# EAGLE design Modular-Sensor-Breakout-Board (EAGLE 5.12)

## Sheet 1 of 7
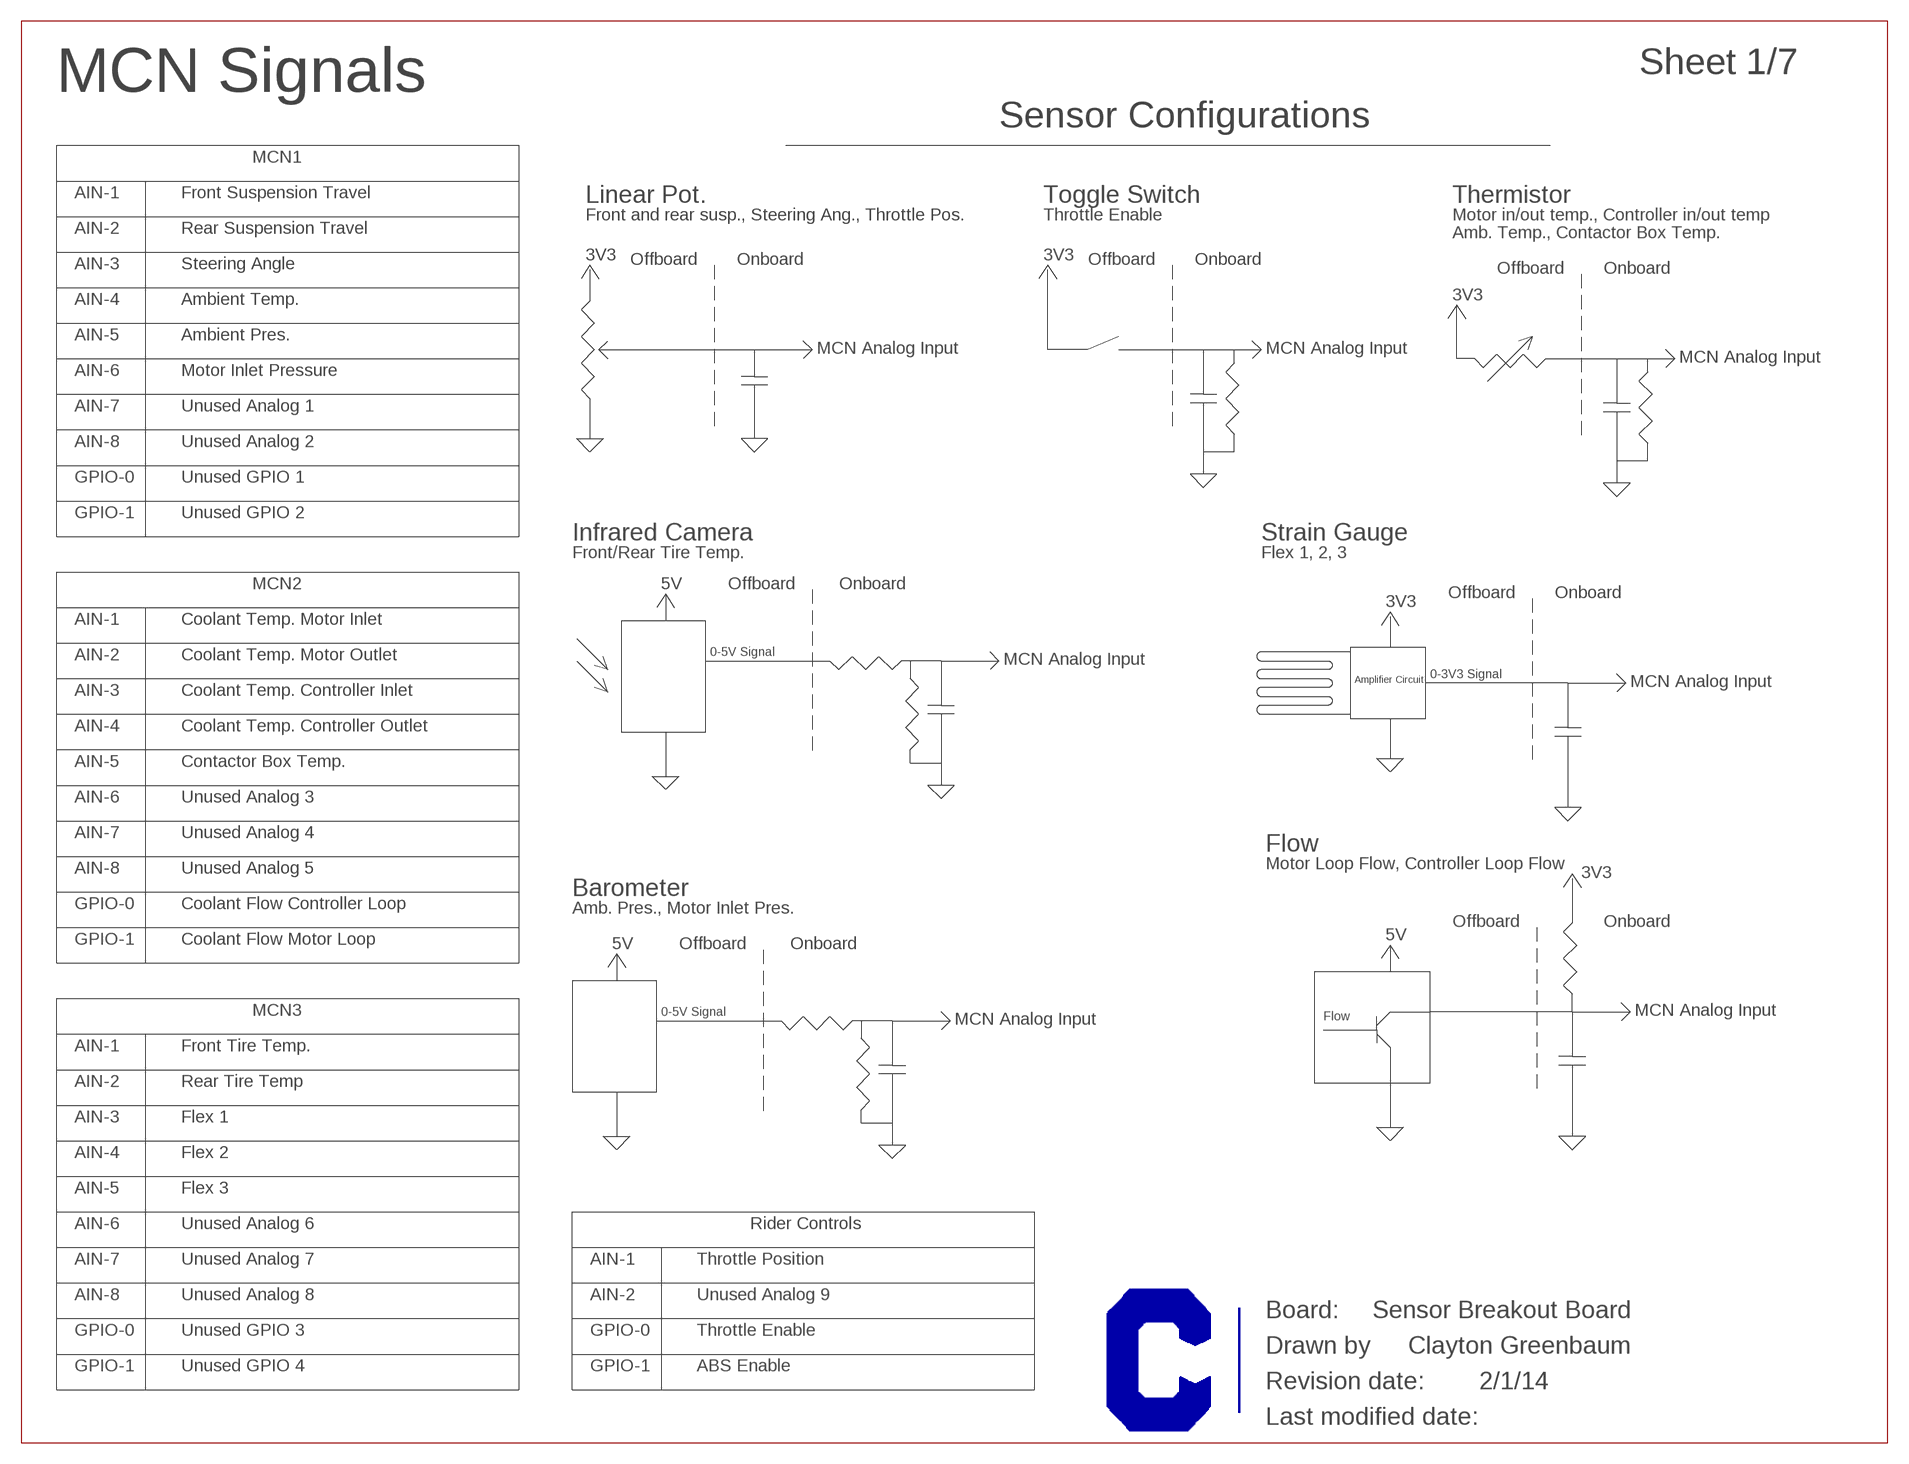
[diagram p0: schematic, sheet 1]

### Notes on the sheet
- MCN Signals
- Sensor Configurations
- MCN1
- AIN-1 | Front Suspension Travel | Linear Pot. | Toggle Switch | Thermistor
- Front and rear susp., Steering Ang., Throttle Pos. | Throttle Enable | Motor in/out temp., Controller in/out temp
- AIN-2 | Rear Suspension Travel | Amb. Temp., Contactor Box Temp.
- 3V3 | Offboard | Onboard | 3V3 | Offboard | Onboard
- AIN-3 | Steering Angle | Offboard | Onboard
- AIN-4 | Ambient Temp. | 3V3
- AIN-5 | Ambient Pres.
- MCN Analog Input | MCN Analog Input
- MCN Analog Input
- AIN-6 | Motor Inlet Pressure
- AIN-7 | Unused Analog 1
- AIN-8 | Unused Analog 2
- GPIO-0 | Unused GPIO 1
- GPIO-1 | Unused GPIO 2
- Infrared Camera | Strain Gauge
- Front/Rear Tire Temp. | Flex 1, 2, 3
- MCN2 | 5V | Offboard | Onboard
- Offboard | Onboard
- 3V3
- AIN-1 | Coolant Temp. Motor Inlet
- 0-5V Signal
- AIN-2 | Coolant Temp. Motor Outlet | MCN Analog Input
- 0-3V3 Signal
- Amplifier Circuit
- MCN Analog Input
- AIN-3 | Coolant Temp. Controller Inlet
- AIN-4 | Coolant Temp. Controller Outlet
- AIN-5 | Contactor Box Temp.
- AIN-6 | Unused Analog 3
- AIN-7 | Unused Analog 4
- Flow
- AIN-8 | Unused Analog 5 | Motor Loop Flow, Controller Loop Flow
- 3V3
- Barometer
- GPIO-0 | Coolant Flow Controller Loop | Amb. Pres., Motor Inlet Pres.
- Offboard | Onboard
- GPIO-1 | Coolant Flow Motor Loop | 5V
- 5V | Offboard | Onboard
- MCN3 | 0-5V Signal | MCN Analog Input
- Flow
- MCN Analog Input
- AIN-1 | Front Tire Temp.
- AIN-2 | Rear Tire Temp
- AIN-3 | Flex 1
- AIN-4 | Flex 2
- AIN-5 | Flex 3
- AIN-6 | Unused Analog 6 | Rider Controls
- AIN-7 | Unused Analog 7 | AIN-1 | Throttle Position
- AIN-8 | Unused Analog 8 | AIN-2 | Unused Analog 9
- Sensor Breakout Board
- GPIO-0 | Unused GPIO 3 | GPIO-0 | Throttle Enable
- Clayton Greenbaum
- GPIO-1 | Unused GPIO 4 | GPIO-1 | ABS Enable
- 2/1/14

## Sheet 2 of 7
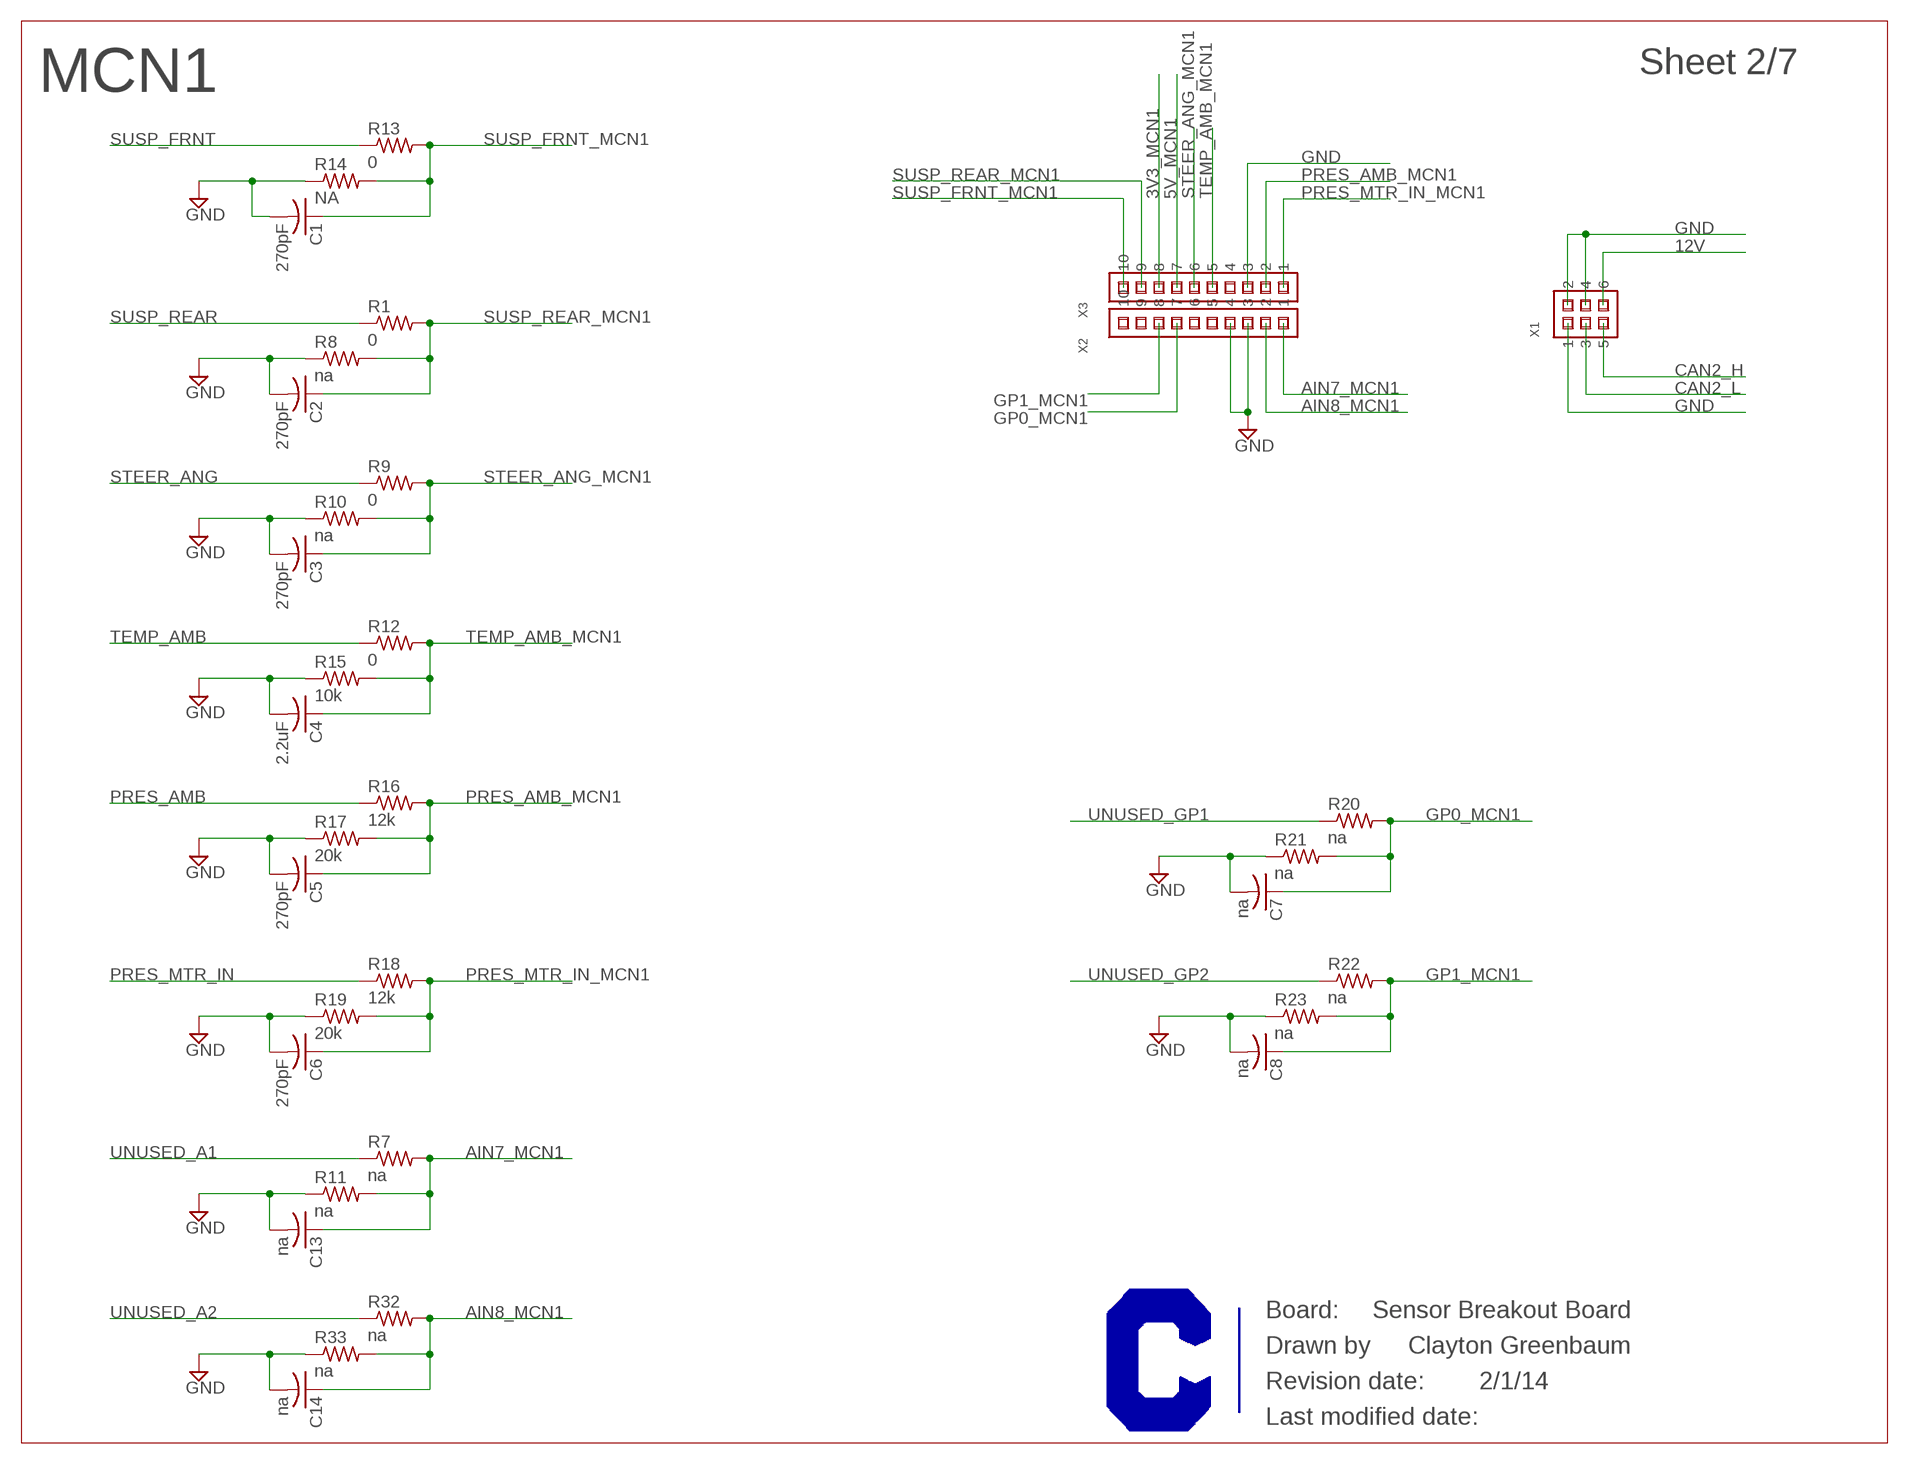
[diagram p1: schematic, sheet 2]

### Parts
C1  270pF  C-USC0603  [C0603]
C2  270pF  C-USC0603  [C0603]
C3  270pF  C-USC0603  [C0603]
C4  2.2uF  C-USC0603  [C0603]
C5  270pF  C-USC0603  [C0603]
C6  270pF  C-USC0603  [C0603]
C7  na  C-USC0603  [C0603]
C8  na  C-USC0603  [C0603]
C13  na  C-USC0603  [C0603]
C14  na  C-USC0603  [C0603]
R1  0  R-US_R0603  [R0603]
R7  na  R-US_R0603  [R0603]
R8  na  R-US_R0603  [R0603]
R9  0  R-US_R0603  [R0603]
R10  na  R-US_R0603  [R0603]
R11  na  R-US_R0603  [R0603]
R12  0  R-US_R0603  [R0603]
R13  0  R-US_R0603  [R0603]
R14  NA  R-US_R0603  [R0603]
R15  10k  R-US_R0603  [R0603]
R16  12k  R-US_R0603  [R0603]
R17  20k  R-US_R0603  [R0603]
R18  12k  R-US_R0603  [R0603]
R19  20k  R-US_R0603  [R0603]
R20  na  R-US_R0603  [R0603]
R21  na  R-US_R0603  [R0603]
R22  na  R-US_R0603  [R0603]
R23  na  R-US_R0603  [R0603]
R32  na  R-US_R0603  [R0603]
R33  na  R-US_R0603  [R0603]
X1  M22-71403XX  [M22-71403XX]
X2  M22-71310XX  [M22-71310XX]
X3  M22-71310XX  [M22-71310XX]

### Nets
3V3_MCN1 [Supply]: X3.8 ; also sheet 7
5V_MCN1 [Supply]: X3.7 ; also sheet 7
12V [Supply]: X1.6 ; also sheet 3,4,5,6,7
AIN7_MCN1: C13.1 R7.2 R11.2 X2.1
AIN8_MCN1: C14.1 R32.2 R33.2 X2.2
CAN2_H: X1.5 ; also sheet 3,4,6,7
CAN2_L: X1.3 ; also sheet 3,4,6,7
GND [Supply]: C1.2 C2.2 C3.2 C4.2 C5.2 C6.2 C7.2 C8.2 C13.2 C14.2 R8.1 R10.1 R11.1 R14.1 R15.1 R17.1 R19.1 R21.1 R23.1 R33.1 X1.1 X1.2 X1.4 X2.3 X2.4 X3.3 ; also sheet 3,4,5,6,7
GP0_MCN1: C7.1 R20.2 R21.2 X2.7
GP1_MCN1: C8.1 R22.2 R23.2 X2.8
PRES_AMB: R16.1 ; also sheet 7
PRES_AMB_MCN1: C5.1 R16.2 R17.2 X3.2
PRES_MTR_IN: R18.1 ; also sheet 7
PRES_MTR_IN_MCN1: C6.1 R18.2 R19.2 X3.1
STEER_ANG: R9.1 ; also sheet 7
STEER_ANG_MCN1: C3.1 R9.2 R10.2 X3.6
SUSP_FRNT: R13.1 ; also sheet 7
SUSP_FRNT_MCN1: C1.1 R13.2 R14.2 X3.10
SUSP_REAR: R1.1 ; also sheet 7
SUSP_REAR_MCN1: C2.1 R1.2 R8.2 X3.9
TEMP_AMB: R12.1 ; also sheet 7
TEMP_AMB_MCN1: C4.1 R12.2 R15.2 X3.5
UNUSED_A1: R7.1 ; also sheet 7
UNUSED_A2: R32.1 ; also sheet 7
UNUSED_GP1: R20.1 ; also sheet 7
UNUSED_GP2: R22.1 ; also sheet 7
Unconnected: X2.5 X2.6 X2.9 X2.10 X3.4

### Notes on the sheet
- MCN1
- Sensor Breakout Board
- Clayton Greenbaum
- 2/1/14

## Sheet 3 of 7
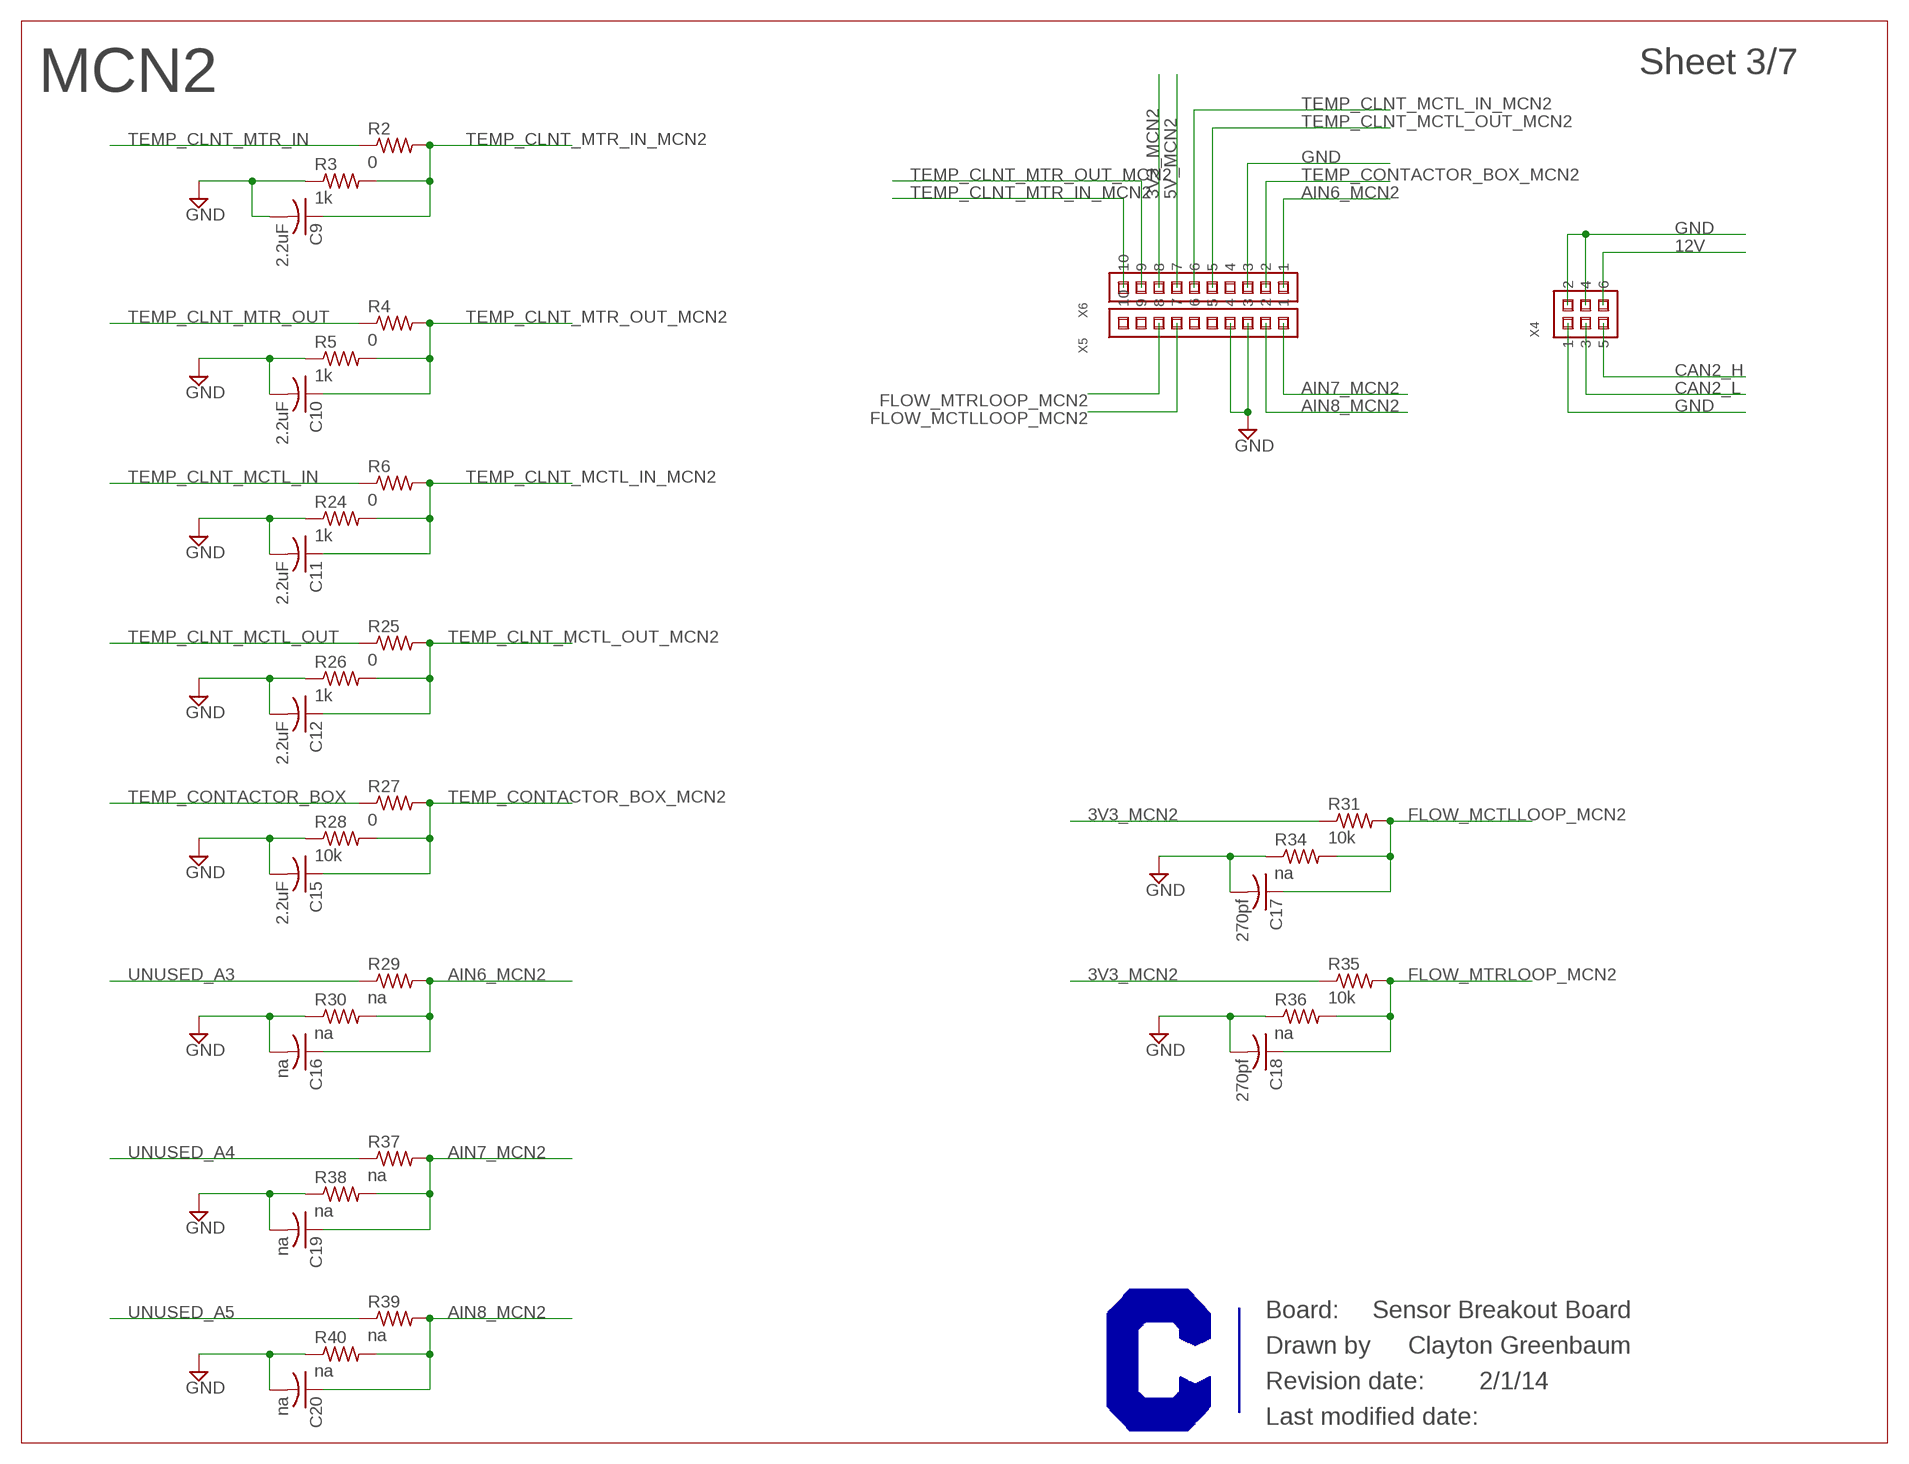
[diagram p2: schematic, sheet 3]

### Parts
C9  2.2uF  C-USC0603  [C0603]
C10  2.2uF  C-USC0603  [C0603]
C11  2.2uF  C-USC0603  [C0603]
C12  2.2uF  C-USC0603  [C0603]
C15  2.2uF  C-USC0603  [C0603]
C16  na  C-USC0603  [C0603]
C17  270pf  C-USC0603  [C0603]
C18  270pf  C-USC0603  [C0603]
C19  na  C-USC0603  [C0603]
C20  na  C-USC0603  [C0603]
R2  0  R-US_R0603  [R0603]
R3  1k  R-US_R0603  [R0603]
R4  0  R-US_R0603  [R0603]
R5  1k  R-US_R0603  [R0603]
R6  0  R-US_R0603  [R0603]
R24  1k  R-US_R0603  [R0603]
R25  0  R-US_R0603  [R0603]
R26  1k  R-US_R0603  [R0603]
R27  0  R-US_R0603  [R0603]
R28  10k  R-US_R0603  [R0603]
R29  na  R-US_R0603  [R0603]
R30  na  R-US_R0603  [R0603]
R31  10k  R-US_R0603  [R0603]
R34  na  R-US_R0603  [R0603]
R35  10k  R-US_R0603  [R0603]
R36  na  R-US_R0603  [R0603]
R37  na  R-US_R0603  [R0603]
R38  na  R-US_R0603  [R0603]
R39  na  R-US_R0603  [R0603]
R40  na  R-US_R0603  [R0603]
X4  M22-71403XX  [M22-71403XX]
X5  M22-71310XX  [M22-71310XX]
X6  M22-71310XX  [M22-71310XX]

### Nets
3V3_MCN2 [Supply]: R31.1 R35.1 X6.8 ; also sheet 7
5V_MCN2 [Supply]: X6.7 ; also sheet 7
12V [Supply]: X4.6 ; also sheet 2,4,5,6,7
AIN6_MCN2: C16.1 R29.2 R30.2 X6.1
AIN7_MCN2: C19.1 R37.2 R38.2 X5.1
AIN8_MCN2: C20.1 R39.2 R40.2 X5.2
CAN2_H: X4.5 ; also sheet 2,4,6,7
CAN2_L: X4.3 ; also sheet 2,4,6,7
FLOW_MCTLLOOP_MCN2: C17.1 R31.2 R34.2 X5.7 ; also sheet 7
FLOW_MTRLOOP_MCN2: C18.1 R35.2 R36.2 X5.8 ; also sheet 7
GND [Supply]: C9.2 C10.2 C11.2 C12.2 C15.2 C16.2 C17.2 C18.2 C19.2 C20.2 R3.1 R5.1 R24.1 R26.1 R28.1 R30.1 R34.1 R36.1 R38.1 R40.1 X4.1 X4.2 X4.4 X5.3 X5.4 X6.3 ; also sheet 2,4,5,6,7
TEMP_CLNT_MCTL_IN: R6.1 ; also sheet 7
TEMP_CLNT_MCTL_IN_MCN2: C11.1 R6.2 R24.2 X6.6
TEMP_CLNT_MCTL_OUT: R25.1 ; also sheet 7
TEMP_CLNT_MCTL_OUT_MCN2: C12.1 R25.2 R26.2 X6.5
TEMP_CLNT_MTR_IN: R2.1 ; also sheet 7
TEMP_CLNT_MTR_IN_MCN2: C9.1 R2.2 R3.2 X6.10
TEMP_CLNT_MTR_OUT: R4.1 ; also sheet 7
TEMP_CLNT_MTR_OUT_MCN2: C10.1 R4.2 R5.2 X6.9
TEMP_CONTACTOR_BOX: R27.1 ; also sheet 7
TEMP_CONTACTOR_BOX_MCN2: C15.1 R27.2 R28.2 X6.2
UNUSED_A3: R29.1 ; also sheet 7
UNUSED_A4: R37.1 ; also sheet 7
UNUSED_A5: R39.1 ; also sheet 7
Unconnected: X5.5 X5.6 X5.9 X5.10 X6.4

### Notes on the sheet
- MCN2
- Sensor Breakout Board
- Clayton Greenbaum
- 2/1/14

## Sheet 4 of 7
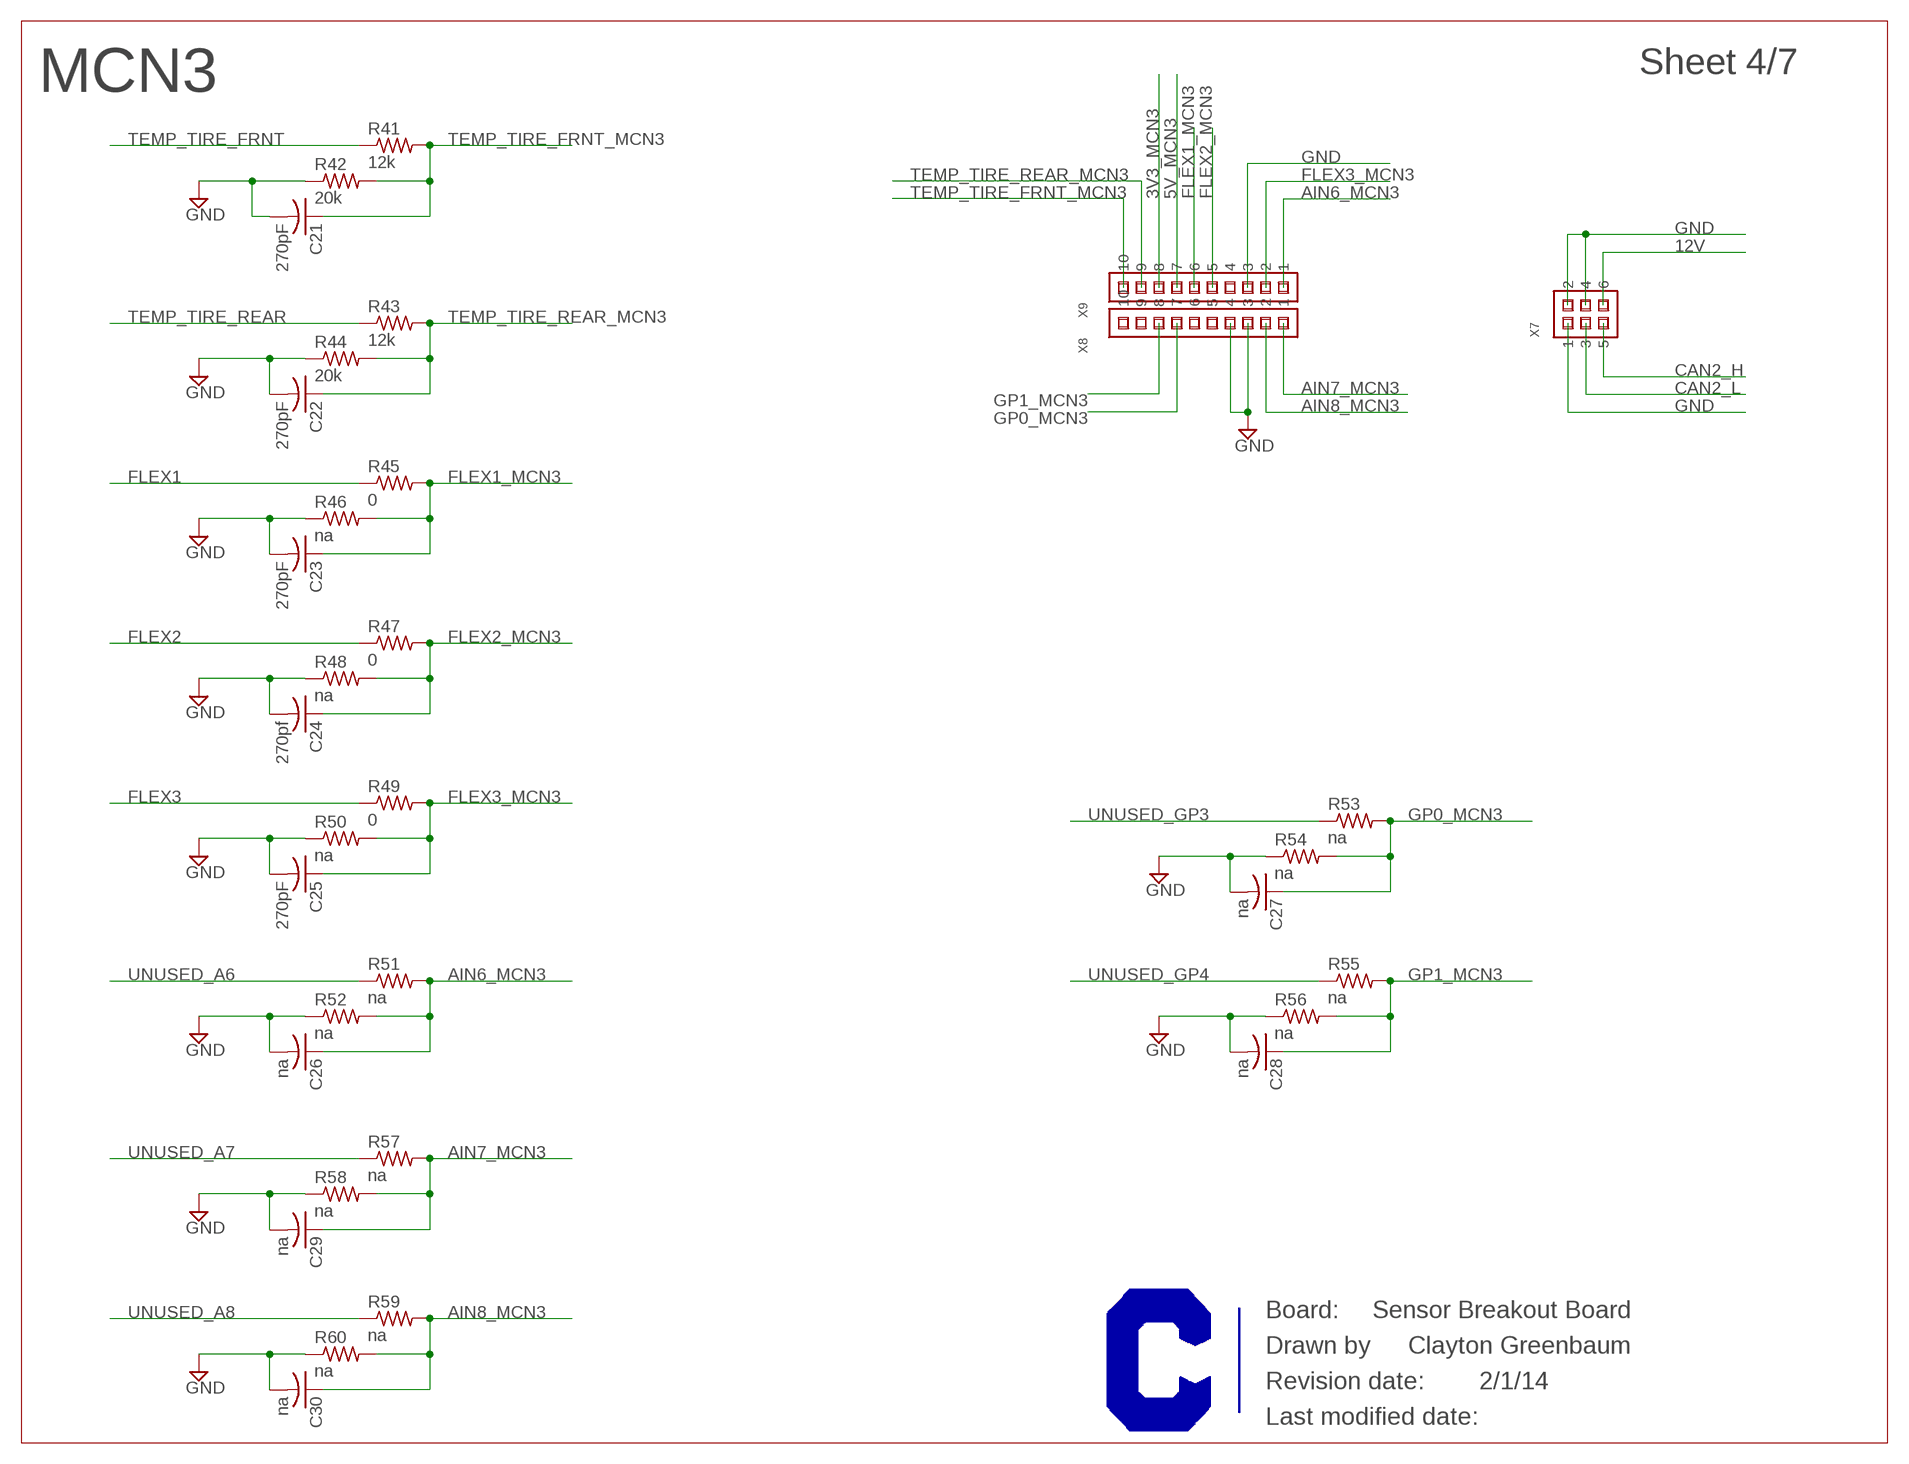
[diagram p3: schematic, sheet 4]

### Parts
C21  270pF  C-USC0603  [C0603]
C22  270pF  C-USC0603  [C0603]
C23  270pF  C-USC0603  [C0603]
C24  270pf  C-USC0603  [C0603]
C25  270pF  C-USC0603  [C0603]
C26  na  C-USC0603  [C0603]
C27  na  C-USC0603  [C0603]
C28  na  C-USC0603  [C0603]
C29  na  C-USC0603  [C0603]
C30  na  C-USC0603  [C0603]
R41  12k  R-US_R0603  [R0603]
R42  20k  R-US_R0603  [R0603]
R43  12k  R-US_R0603  [R0603]
R44  20k  R-US_R0603  [R0603]
R45  0  R-US_R0603  [R0603]
R46  na  R-US_R0603  [R0603]
R47  0  R-US_R0603  [R0603]
R48  na  R-US_R0603  [R0603]
R49  0  R-US_R0603  [R0603]
R50  na  R-US_R0603  [R0603]
R51  na  R-US_R0603  [R0603]
R52  na  R-US_R0603  [R0603]
R53  na  R-US_R0603  [R0603]
R54  na  R-US_R0603  [R0603]
R55  na  R-US_R0603  [R0603]
R56  na  R-US_R0603  [R0603]
R57  na  R-US_R0603  [R0603]
R58  na  R-US_R0603  [R0603]
R59  na  R-US_R0603  [R0603]
R60  na  R-US_R0603  [R0603]
X7  M22-71403XX  [M22-71403XX]
X8  M22-71310XX  [M22-71310XX]
X9  M22-71310XX  [M22-71310XX]

### Nets
3V3_MCN3 [Supply]: X9.8 ; also sheet 7
5V_MCN3 [Supply]: X9.7 ; also sheet 7
12V [Supply]: X7.6 ; also sheet 2,3,5,6,7
AIN6_MCN3: C26.1 R51.2 R52.2 X9.1
AIN7_MCN3: C29.1 R57.2 R58.2 X8.1
AIN8_MCN3: C30.1 R59.2 R60.2 X8.2
CAN2_H: X7.5 ; also sheet 2,3,6,7
CAN2_L: X7.3 ; also sheet 2,3,6,7
FLEX1: R45.1 ; also sheet 7
FLEX1_MCN3: C23.1 R45.2 R46.2 X9.6
FLEX2: R47.1 ; also sheet 7
FLEX2_MCN3: C24.1 R47.2 R48.2 X9.5
FLEX3: R49.1 ; also sheet 7
FLEX3_MCN3: C25.1 R49.2 R50.2 X9.2
GND [Supply]: C21.2 C22.2 C23.2 C24.2 C25.2 C26.2 C27.2 C28.2 C29.2 C30.2 R42.1 R44.1 R46.1 R48.1 R50.1 R52.1 R54.1 R56.1 R58.1 R60.1 X7.1 X7.2 X7.4 X8.3 X8.4 X9.3 ; also sheet 2,3,5,6,7
GP0_MCN3: C27.1 R53.2 R54.2 X8.7
GP1_MCN3: C28.1 R55.2 R56.2 X8.8
TEMP_TIRE_FRNT: R41.1 ; also sheet 7
TEMP_TIRE_FRNT_MCN3: C21.1 R41.2 R42.2 X9.10
TEMP_TIRE_REAR: R43.1 ; also sheet 7
TEMP_TIRE_REAR_MCN3: C22.1 R43.2 R44.2 X9.9
UNUSED_A6: R51.1 ; also sheet 7
UNUSED_A7: R57.1 ; also sheet 7
UNUSED_A8: R59.1 ; also sheet 7
UNUSED_GP3: R53.1 ; also sheet 7
UNUSED_GP4: R55.1 ; also sheet 7
Unconnected: X8.5 X8.6 X8.9 X8.10 X9.4

### Notes on the sheet
- MCN3
- Sensor Breakout Board
- Clayton Greenbaum
- 2/1/14

## Sheet 5 of 7
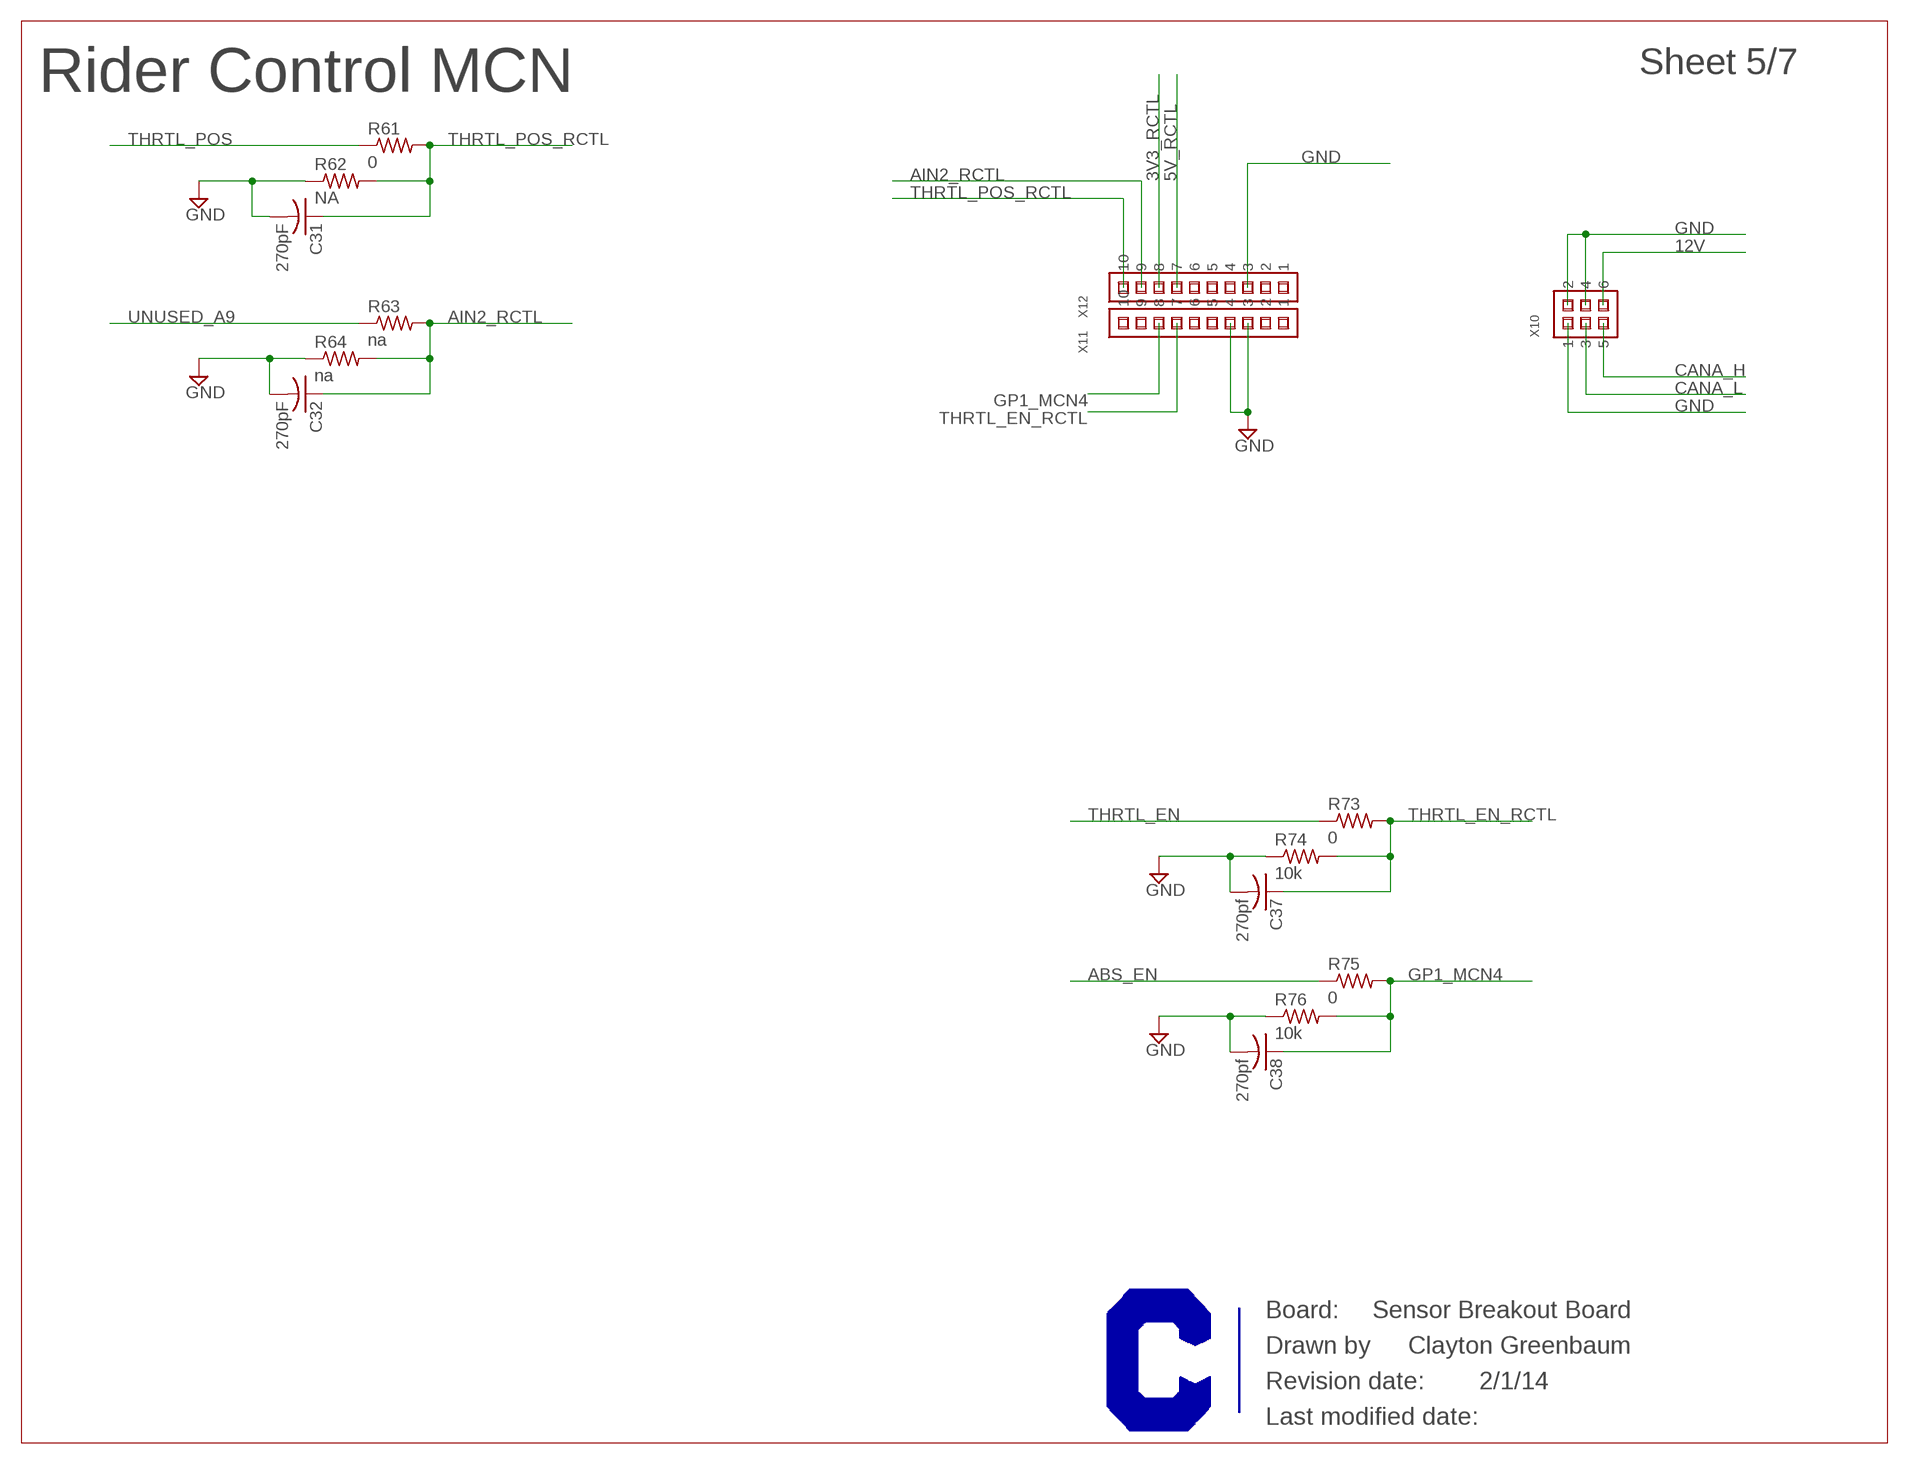
[diagram p4: schematic, sheet 5]

### Parts
C31  270pF  C-USC0603  [C0603]
C32  270pF  C-USC0603  [C0603]
C37  270pf  C-USC0603  [C0603]
C38  270pf  C-USC0603  [C0603]
R61  0  R-US_R0603  [R0603]
R62  NA  R-US_R0603  [R0603]
R63  na  R-US_R0603  [R0603]
R64  na  R-US_R0603  [R0603]
R73  0  R-US_R0603  [R0603]
R74  10k  R-US_R0603  [R0603]
R75  0  R-US_R0603  [R0603]
R76  10k  R-US_R0603  [R0603]
X10  M22-71403XX  [M22-71403XX]
X11  M22-71310XX  [M22-71310XX]
X12  M22-71310XX  [M22-71310XX]

### Nets
3V3_RCTL [Supply]: X12.8 ; also sheet 7
5V_RCTL [Supply]: X12.7 ; also sheet 7
12V [Supply]: X10.6 ; also sheet 2,3,4,6,7
ABS_EN: R75.1 ; also sheet 7
AIN2_RCTL: C32.1 R63.2 R64.2 X12.9
CANA_H: X10.5 ; also sheet 6,7
CANA_L: X10.3 ; also sheet 6,7
GND [Supply]: C31.2 C32.2 C37.2 C38.2 R62.1 R64.1 R74.1 R76.1 X10.1 X10.2 X10.4 X11.3 X11.4 X12.3 ; also sheet 2,3,4,6,7
GP1_MCN4: C38.1 R75.2 R76.2 X11.8
THRTL_EN: R73.1 ; also sheet 7
THRTL_EN_RCTL: C37.1 R73.2 R74.2 X11.7
THRTL_POS: R61.1 ; also sheet 7
THRTL_POS_RCTL: C31.1 R61.2 R62.2 X12.10
UNUSED_A9: R63.1 ; also sheet 7
Unconnected: X11.1 X11.2 X11.5 X11.6 X11.9 X11.10 X12.1 X12.2 X12.4 X12.5 X12.6

### Notes on the sheet
- Rider Control MCN
- Sensor Breakout Board
- Clayton Greenbaum
- 2/1/14

## Sheet 6 of 7
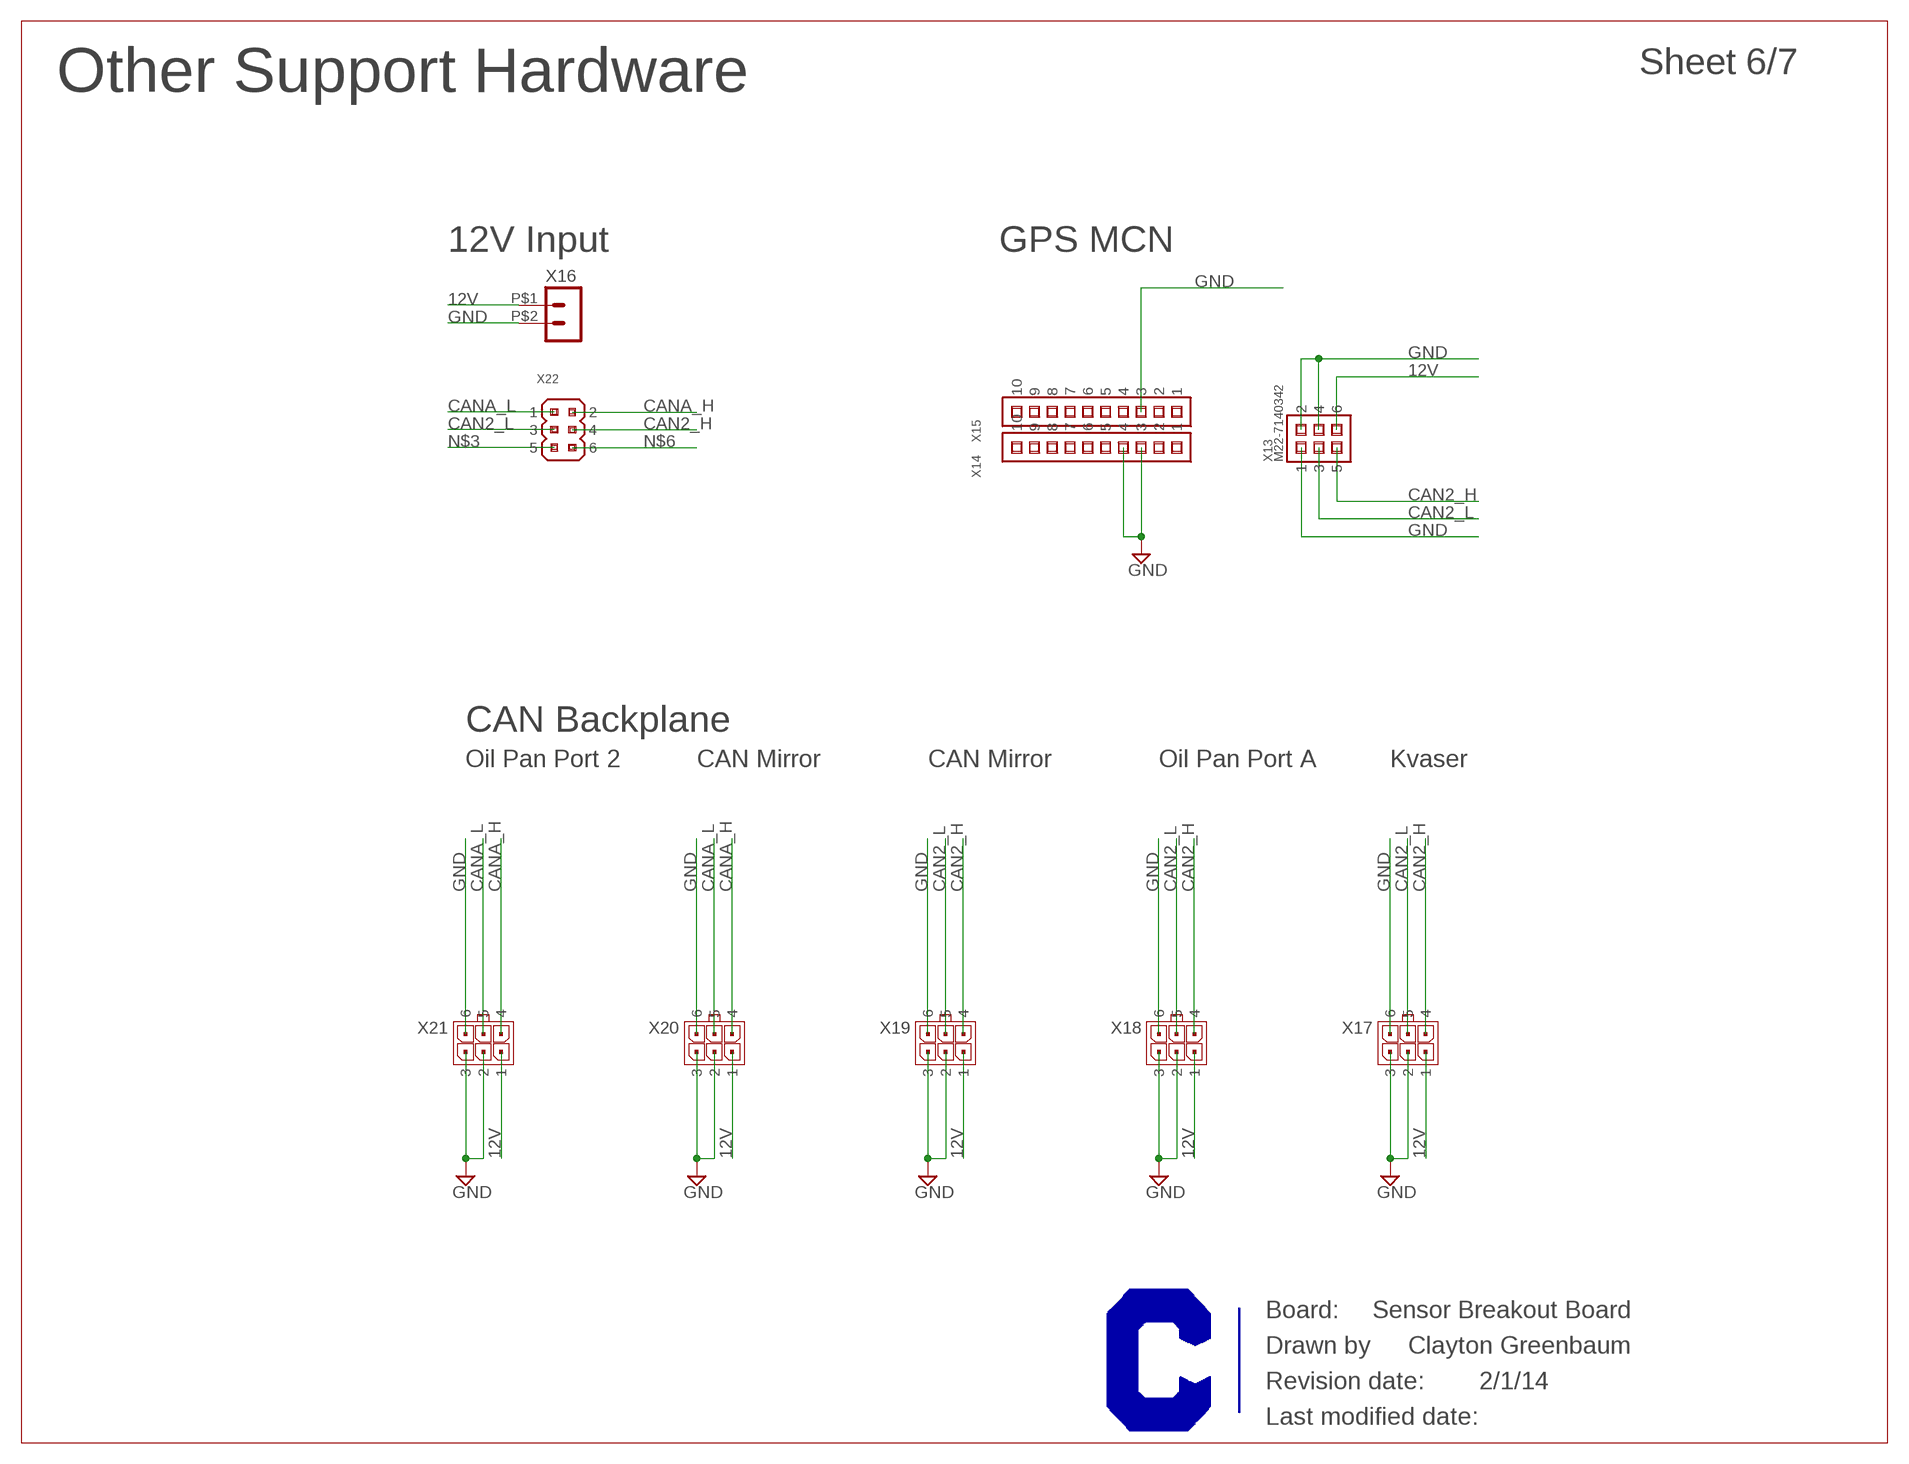
[diagram p5: schematic, sheet 6]

### Parts
X13  M22-7140342  M22-71403XX  [M22-71403XX]
X14  M22-71310XX  [M22-71310XX]
X15  M22-71310XX  [M22-71310XX]
X16  HEADER_POS2_43045-0200  [43045-0200]
X17  MICROFIT-06-DUAL-THROUGH_HOLE-PEG_RETENTION-GOLD  [MICROFIT-6-DUAL-RA-THROUGH_HOLE-PEG_RETENTION]
X18  MICROFIT-06-DUAL-THROUGH_HOLE-PEG_RETENTION-GOLD  [MICROFIT-6-DUAL-RA-THROUGH_HOLE-PEG_RETENTION]
X19  MICROFIT-06-DUAL-THROUGH_HOLE-PEG_RETENTION-GOLD  [MICROFIT-6-DUAL-RA-THROUGH_HOLE-PEG_RETENTION]
X20  MICROFIT-06-DUAL-THROUGH_HOLE-PEG_RETENTION-GOLD  [MICROFIT-6-DUAL-RA-THROUGH_HOLE-PEG_RETENTION]
X21  MICROFIT-06-DUAL-THROUGH_HOLE-PEG_RETENTION-GOLD  [MICROFIT-6-DUAL-RA-THROUGH_HOLE-PEG_RETENTION]
X22  M22-25203XX  [M22-25203XX]

### Nets
12V [Supply]: X13.6 X16.P$1 X17.1 X18.1 X19.1 X20.1 X21.1 ; also sheet 2,3,4,5,7
CAN2_H: X13.5 X17.4 X18.4 X19.4 X22.4 ; also sheet 2,3,4,7
CAN2_L: X13.3 X17.5 X18.5 X19.5 X22.3 ; also sheet 2,3,4,7
CANA_H: X20.4 X21.4 X22.2 ; also sheet 5,7
CANA_L: X20.5 X21.5 X22.1 ; also sheet 5,7
GND [Supply]: X13.1 X13.2 X13.4 X14.3 X14.4 X15.3 X16.P$2 X17.2 X17.3 X17.6 X18.2 X18.3 X18.6 X19.2 X19.3 X19.6 X20.2 X20.3 X20.6 X21.2 X21.3 X21.6 ; also sheet 2,3,4,5,7
N$3: X22.5
N$6: X22.6
Unconnected: X14.1 X14.2 X14.5 X14.6 X14.7 X14.8 X14.9 X14.10 X15.1 X15.2 X15.4 X15.5 X15.6 X15.7 X15.8 X15.9 X15.10

### Notes on the sheet
- Other Support Hardware
- 12V Input | GPS MCN
- CAN Backplane
- Oil Pan Port 2 | CAN Mirror | CAN Mirror | Oil Pan Port A | Kvaser
- Sensor Breakout Board
- Clayton Greenbaum
- 2/1/14

## Sheet 7 of 7
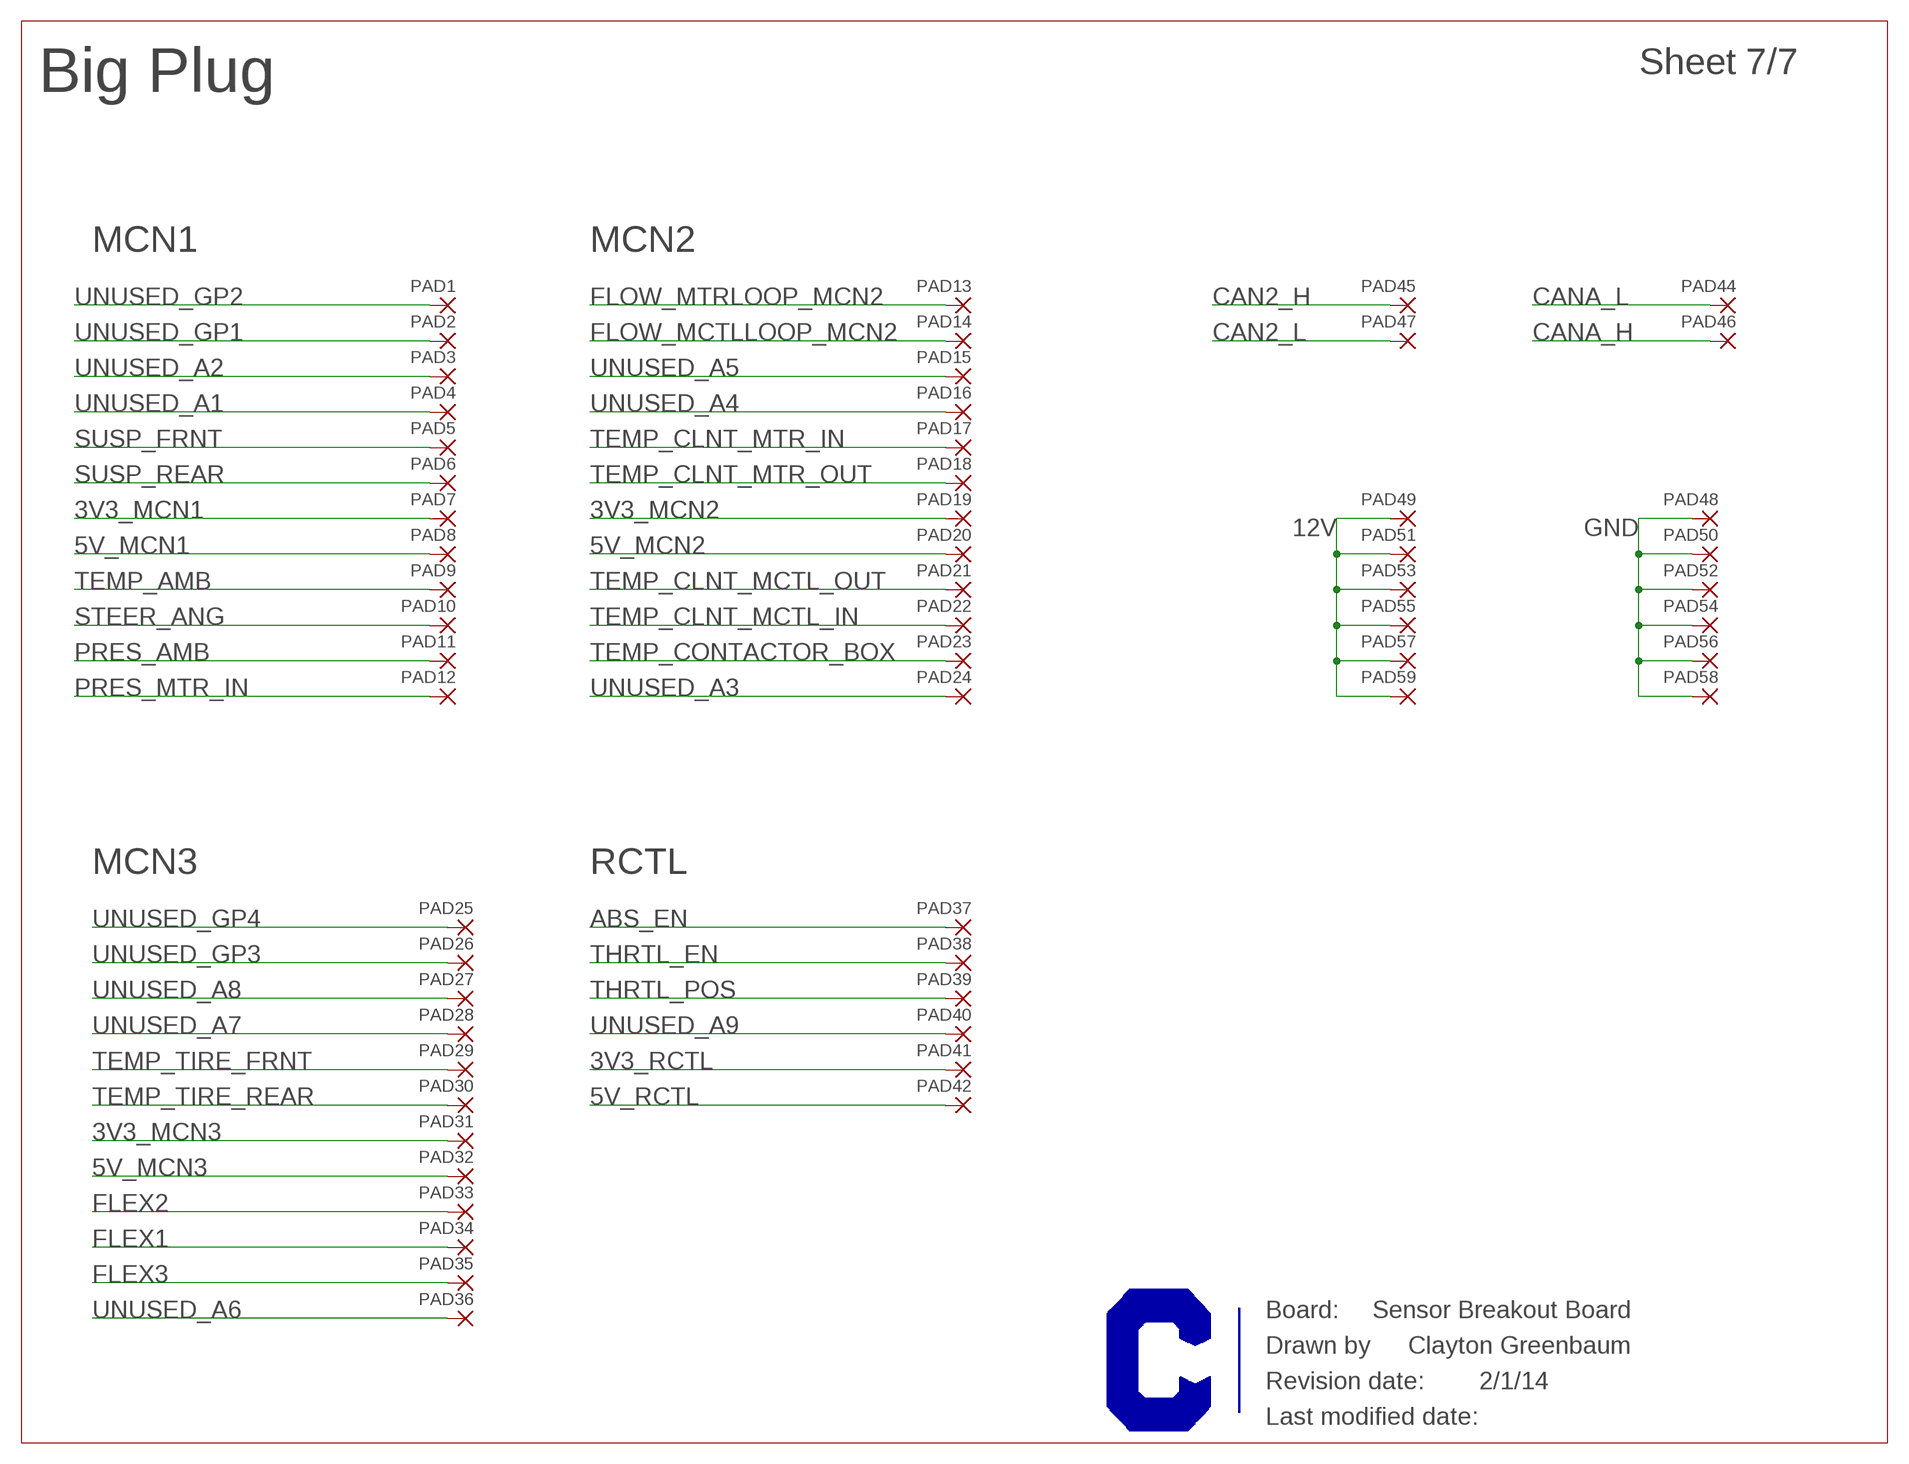
[diagram p6: schematic, sheet 7]

### Parts
PAD1  2,54/0,9  [2,54/0,9]
PAD2  2,54/0,9  [2,54/0,9]
PAD3  2,54/0,9  [2,54/0,9]
PAD4  2,54/0,9  [2,54/0,9]
PAD5  2,54/0,9  [2,54/0,9]
PAD6  2,54/0,9  [2,54/0,9]
PAD7  2,54/0,9  [2,54/0,9]
PAD8  2,54/0,9  [2,54/0,9]
PAD9  2,54/0,9  [2,54/0,9]
PAD10  2,54/0,9  [2,54/0,9]
PAD11  2,54/0,9  [2,54/0,9]
PAD12  2,54/0,9  [2,54/0,9]
PAD13  2,54/0,9  [2,54/0,9]
PAD14  2,54/0,9  [2,54/0,9]
PAD15  2,54/0,9  [2,54/0,9]
PAD16  2,54/0,9  [2,54/0,9]
PAD17  2,54/0,9  [2,54/0,9]
PAD18  2,54/0,9  [2,54/0,9]
PAD19  2,54/0,9  [2,54/0,9]
PAD20  2,54/0,9  [2,54/0,9]
PAD21  2,54/0,9  [2,54/0,9]
PAD22  2,54/0,9  [2,54/0,9]
PAD23  2,54/0,9  [2,54/0,9]
PAD24  2,54/0,9  [2,54/0,9]
PAD25  2,54/0,9  [2,54/0,9]
PAD26  2,54/0,9  [2,54/0,9]
PAD27  2,54/0,9  [2,54/0,9]
PAD28  2,54/0,9  [2,54/0,9]
PAD29  2,54/0,9  [2,54/0,9]
PAD30  2,54/0,9  [2,54/0,9]
PAD31  2,54/0,9  [2,54/0,9]
PAD32  2,54/0,9  [2,54/0,9]
PAD33  2,54/0,9  [2,54/0,9]
PAD34  2,54/0,9  [2,54/0,9]
PAD35  2,54/0,9  [2,54/0,9]
PAD36  2,54/0,9  [2,54/0,9]
PAD37  2,54/0,9  [2,54/0,9]
PAD38  2,54/0,9  [2,54/0,9]
PAD39  2,54/0,9  [2,54/0,9]
PAD40  2,54/0,9  [2,54/0,9]
PAD41  2,54/0,9  [2,54/0,9]
PAD42  2,54/0,9  [2,54/0,9]
PAD44  2,54/0,9  [2,54/0,9]
PAD45  2,54/0,9  [2,54/0,9]
PAD46  2,54/0,9  [2,54/0,9]
PAD47  2,54/0,9  [2,54/0,9]
PAD48  2,54/0,9  [2,54/0,9]
PAD49  2,54/0,9  [2,54/0,9]
PAD50  2,54/0,9  [2,54/0,9]
PAD51  2,54/0,9  [2,54/0,9]
PAD52  2,54/0,9  [2,54/0,9]
PAD53  2,54/0,9  [2,54/0,9]
PAD54  2,54/0,9  [2,54/0,9]
PAD55  2,54/0,9  [2,54/0,9]
PAD56  2,54/0,9  [2,54/0,9]
PAD57  2,54/0,9  [2,54/0,9]
PAD58  2,54/0,9  [2,54/0,9]
PAD59  2,54/0,9  [2,54/0,9]

### Nets
3V3_MCN1 [Supply]: PAD7.1(P) ; also sheet 2
3V3_MCN2 [Supply]: PAD19.1(P) ; also sheet 3
3V3_MCN3 [Supply]: PAD31.1(P) ; also sheet 4
3V3_RCTL [Supply]: PAD41.1(P) ; also sheet 5
5V_MCN1 [Supply]: PAD8.1(P) ; also sheet 2
5V_MCN2 [Supply]: PAD20.1(P) ; also sheet 3
5V_MCN3 [Supply]: PAD32.1(P) ; also sheet 4
5V_RCTL [Supply]: PAD42.1(P) ; also sheet 5
12V [Supply]: PAD49.1(P) PAD51.1(P) PAD53.1(P) PAD55.1(P) PAD57.1(P) PAD59.1(P) ; also sheet 2,3,4,5,6
ABS_EN: PAD37.1(P) ; also sheet 5
CAN2_H: PAD45.1(P) ; also sheet 2,3,4,6
CAN2_L: PAD47.1(P) ; also sheet 2,3,4,6
CANA_H: PAD46.1(P) ; also sheet 5,6
CANA_L: PAD44.1(P) ; also sheet 5,6
FLEX1: PAD34.1(P) ; also sheet 4
FLEX2: PAD33.1(P) ; also sheet 4
FLEX3: PAD35.1(P) ; also sheet 4
FLOW_MCTLLOOP_MCN2: PAD14.1(P) ; also sheet 3
FLOW_MTRLOOP_MCN2: PAD13.1(P) ; also sheet 3
GND [Supply]: PAD48.1(P) PAD50.1(P) PAD52.1(P) PAD54.1(P) PAD56.1(P) PAD58.1(P) ; also sheet 2,3,4,5,6
PRES_AMB: PAD11.1(P) ; also sheet 2
PRES_MTR_IN: PAD12.1(P) ; also sheet 2
STEER_ANG: PAD10.1(P) ; also sheet 2
SUSP_FRNT: PAD5.1(P) ; also sheet 2
SUSP_REAR: PAD6.1(P) ; also sheet 2
TEMP_AMB: PAD9.1(P) ; also sheet 2
TEMP_CLNT_MCTL_IN: PAD22.1(P) ; also sheet 3
TEMP_CLNT_MCTL_OUT: PAD21.1(P) ; also sheet 3
TEMP_CLNT_MTR_IN: PAD17.1(P) ; also sheet 3
TEMP_CLNT_MTR_OUT: PAD18.1(P) ; also sheet 3
TEMP_CONTACTOR_BOX: PAD23.1(P) ; also sheet 3
TEMP_TIRE_FRNT: PAD29.1(P) ; also sheet 4
TEMP_TIRE_REAR: PAD30.1(P) ; also sheet 4
THRTL_EN: PAD38.1(P) ; also sheet 5
THRTL_POS: PAD39.1(P) ; also sheet 5
UNUSED_A1: PAD4.1(P) ; also sheet 2
UNUSED_A2: PAD3.1(P) ; also sheet 2
UNUSED_A3: PAD24.1(P) ; also sheet 3
UNUSED_A4: PAD16.1(P) ; also sheet 3
UNUSED_A5: PAD15.1(P) ; also sheet 3
UNUSED_A6: PAD36.1(P) ; also sheet 4
UNUSED_A7: PAD28.1(P) ; also sheet 4
UNUSED_A8: PAD27.1(P) ; also sheet 4
UNUSED_A9: PAD40.1(P) ; also sheet 5
UNUSED_GP1: PAD2.1(P) ; also sheet 2
UNUSED_GP2: PAD1.1(P) ; also sheet 2
UNUSED_GP3: PAD26.1(P) ; also sheet 4
UNUSED_GP4: PAD25.1(P) ; also sheet 4

### Notes on the sheet
- Big Plug
- MCN1 | MCN2
- MCN3 | RCTL
- Sensor Breakout Board
- Clayton Greenbaum
- 2/1/14

## Library data of the parts
C1-C32 C37 C38 = resistor:C-US: CAPACITOR, American symbol
PAD1-PAD42 PAD44-PAD59 = wirepad:2,54/0,9: THROUGH-HOLE PAD
R1-R64 R73-R76 = rcl:R-US_: RESISTOR, American symbol
X1 X4 X7 X10 X13 = Harwin:M22-71403XX: M22-71403XX - 2x3 pos female header assy, 2.0mm pitch Datasheet: https://cdn.harwin.com/pdfs/M22-714.pdf; PARTNO: M22-7140342
X2 X3 X5 X6 X8 X9 X11 X12 X14 X15 = Harwin:M22-71310XX: Harwin M22-71310XX - 10pos single row female pin hdr, 2mm pitch Datasheet: https://cdn.harwin.com/pdfs/M22-713.pdf; PARTNO: M22-7131042
X16 = con-molex-micro-fit-3_0:HEADER_POS2_?: Molex - Micro-Fit 3.0 Series connector, 3.00mm (0.118") pitch header, 2 positions.
X17-X21 = Molex:MICROFIT-06-DUAL: Molex MicroFit 3.00mm Pitch Header, Surface Mount, Dual Row, 6 Circuits Note, November 2014: These come in three styles: Through-hole, with metal clip retention to PCB (not currently represented) (cheapest) SMD, with solder tab retention (-SMD) (more expensive, commonly stocked) SMD, with metal clip retention (-SMD-CLIP_RETENTION) (most expensive, not often stocked) Please use them in that order! Drawing: http://www.molex.com/pdm_docs/sd/430450609_sd.pdf (right-angle) Information: http://www.molex.com/molex/products/datasheet.jsp?part=active/0430450618_PCB_HEADERS.xml; PARTNO: 43045-0601
X22 = Harwin:M22-25203XX: M22-25203xx - 2.0mm pitch, 3x2 position male pin header Datasheet: https://cdn.harwin.com/pdfs/M22-252.pdf; PARTNO: M22-2520305

## Net classes
1 Supply: width 0.406 mm

## Board
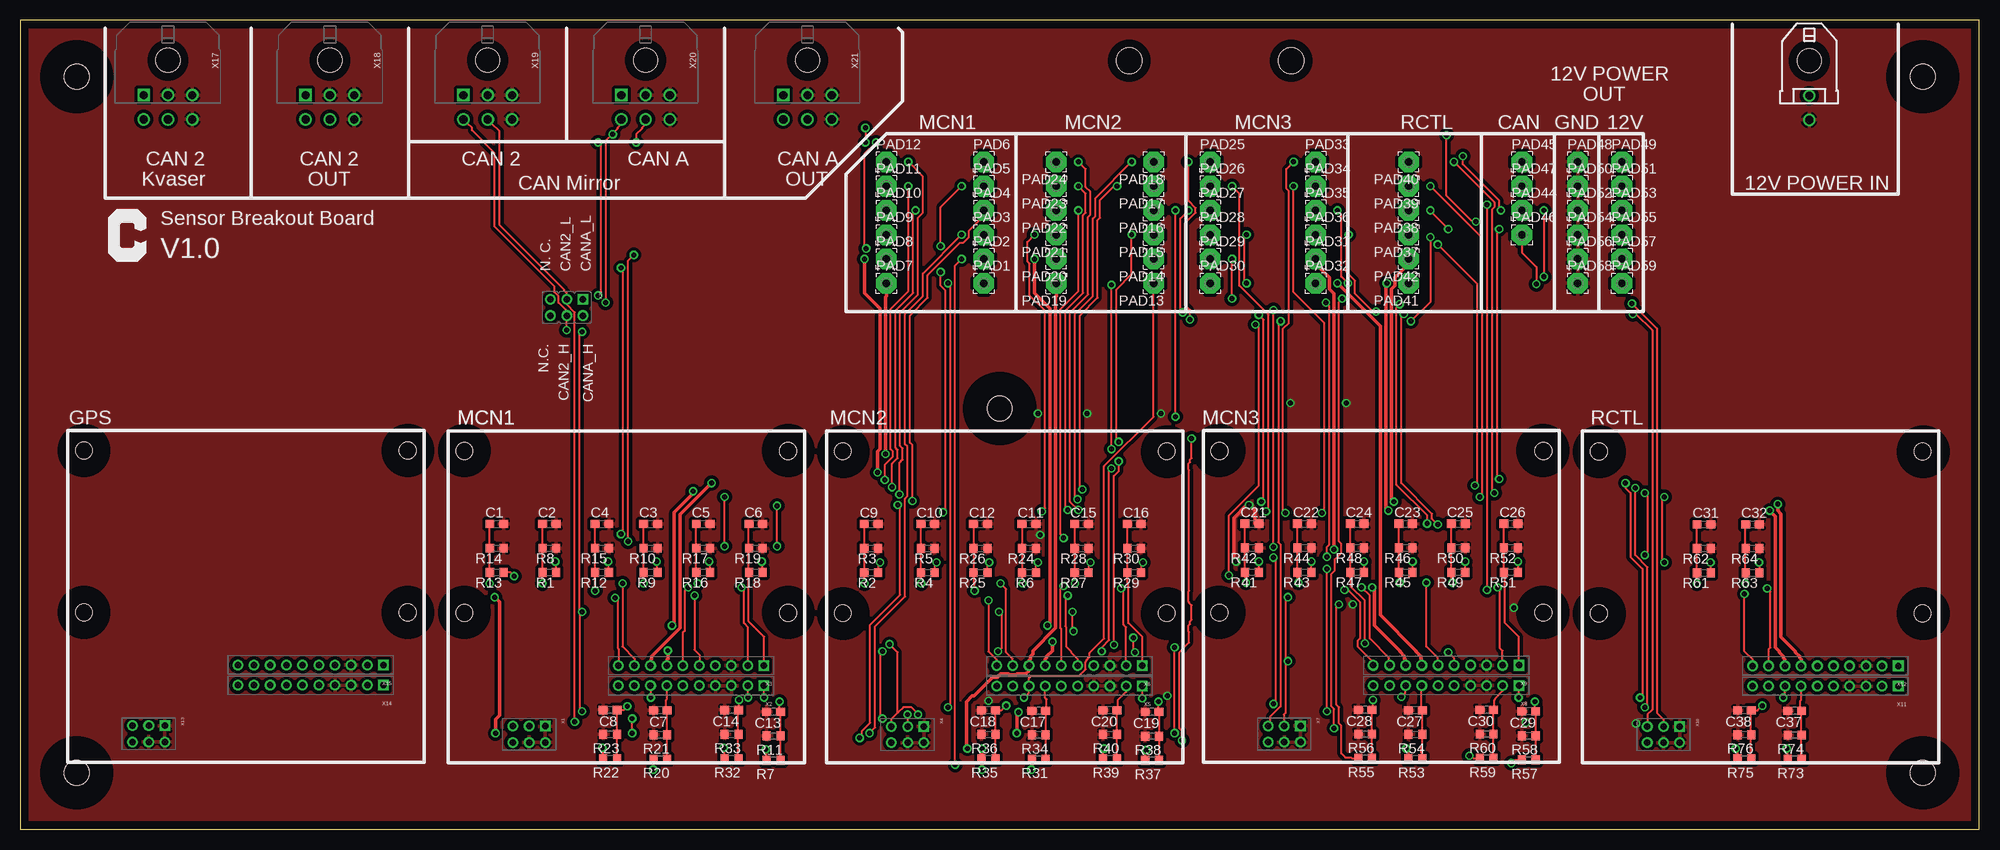
[diagram p7: board, top side]
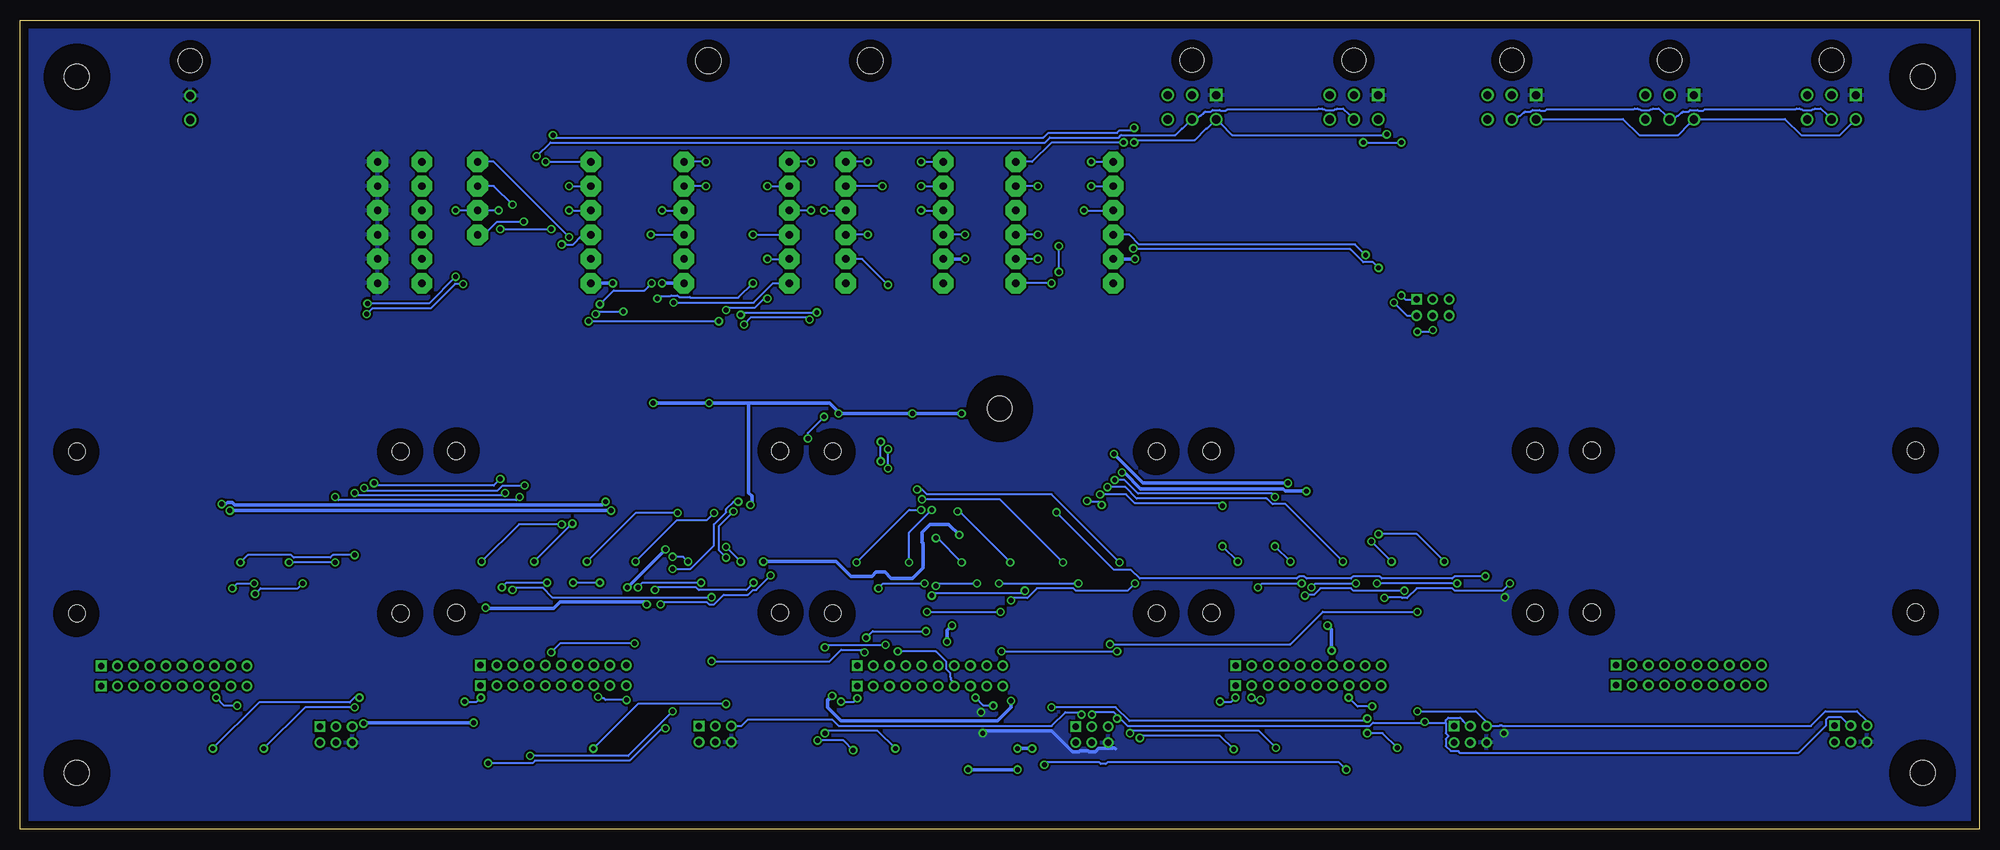
[diagram p8: board, bottom side, seen from below]

Size 242 x 100 mm. Coordinates in mm from the lower left corner, seen from the top.
Outline: 0,0 242,0 242,100 0,100 0,0
Copper layers (1*16): Top 0.035mm / dielectric 1.5mm / Bottom 0.035mm
Design rules "default *": minimum track width 10mil, minimum drill 24mil, track to track 10mil, track to pad 8mil, pad to pad 8mil, via to via 8mil, smd to smd 8mil, copper to edge 40mil, drill to drill 8mil, minimum pad ring 10mil, minimum via ring 8mil, stop-mask expansion 4mil, vias tented up to drill 0mil, thermal gap 10mil
Holes 2.1 mm at 94.86,26.75 94.86,46.76 54.87,46.76 54.87,26.75 141.62,26.73 141.62,46.73 101.61,46.73 101.61,26.73 188.15,26.79 188.15,46.78 148.15,46.78 148.15,26.79 235,26.71 235,46.72 195,46.72 195,26.71 47.88,26.82 47.88,46.83 7.88,46.83 7.88,26.82
Holes 3.1 mm at 7,93 7,7 121,52 235,7 235,93
Holes 3.2 mm at 137,95 157,95
tRestrict: area 3.1,89.1 to 10.9,96.9; area 3.1,3.1 to 10.9,10.9; area 117.1,48.1 to 124.9,55.9; area 231.1,3.1 to 238.9,10.9; area 231.1,89.1 to 238.9,96.9; area 5.2,44.2 to 10.5,49.5; area 5.2,24.2 to 10.5,29.5; area 45.2,24.2 to 50.5,29.5; area 45.2,44.2 to 50.5,49.5; area 52.2,44.2 to 57.5,49.5; area 52.2,24.2 to 57.5,29.5; area 92.2,24.2 to 97.5,29.5; 13 more areas
bRestrict: area 3.1,89.1 to 10.9,96.9; area 3.1,3.1 to 10.9,10.9; area 117.1,48.1 to 124.9,55.9; area 231.1,3.1 to 238.9,10.9; area 231.1,89.1 to 238.9,96.9; area 5.2,44.2 to 10.5,49.5; area 45.2,24.2 to 50.5,29.5; area 45.2,44.2 to 50.5,49.5; area 5.2,24.2 to 10.5,29.5; area 52.2,44.2 to 57.5,49.5; area 92.2,24.2 to 97.5,29.5; area 92.2,44.2 to 97.5,49.5; 13 more areas

### Footprints (pad centres in the part's own frame; a part is rotated, then mirrored left to right if it is on the bottom)
C0603 = smd 1.1 x 1: 1 -0.85,0; 2 0.85,0
2,54/0,9 = drill 0.914 pad 2.54 octagon: 1 0,0
R0603 = smd 1 x 1.1: 1 -0.85,0; 2 0.85,0
M22-71403XX = drill 0.8 square: 1 -1,2 | drill 0.8 round: 2 1,2; 3 -1,0; 4 1,0; 5 -1,-2; 6 1,-2
M22-71310XX = drill 0.8 square: 1 0,-9 | drill 0.8 round: 2 0,-7; 3 0,-5; 4 0,-3; 5 0,-1; 6 0,1; 7 0,3; 8 0,5; 9 0,7; 10 0,9
43045-0200 = drill 1.02 round: P$1 0,4.32; P$2 0,7.32 | hole 3: 0,0
MICROFIT-6-DUAL-RA-THROUGH_HOLE-PEG_RETENTION = drill 1.02 square: 1 3,0 | drill 1.02 round: 2 0,0; 3 -3,0; 4 3,3; 5 0,3; 6 -3,3 | hole 3: 0,-4.32
M22-25203XX = drill 0.8 square: 1 -1,2 | drill 0.8 round: 2 1,2; 3 -1,0; 4 1,0; 5 -1,-2; 6 1,-2

### Placement (x,y rotation side)
C1  58.87,37.76 0 top
C2  65.37,37.76 0 top
C3  77.86,37.76 0 top
C4  71.86,37.76 0 top
C5  84.36,37.76 0 top
C6  90.86,37.76 0 top
C7  79.06,14.71 180 top
C8  72.86,14.76 180 top
C9  105.11,37.73 0 top
C10  112.11,37.73 0 top
C11  124.61,37.73 0 top
C12  118.61,37.73 0 top
C13  93.06,14.55 180 top
C14  87.86,14.76 180 top
C15  131.12,37.73 0 top
C16  137.62,37.73 0 top
C17  125.81,14.69 180 top
C18  119.61,14.73 180 top
C19  139.81,14.54 180 top
C20  134.62,14.73 180 top
C21  152.15,37.78 0 top
C22  158.65,37.78 0 top
C23  171.15,37.78 0 top
C24  165.15,37.78 0 top
C25  177.65,37.78 0 top
C26  184.15,37.78 0 top
C27  172.34,14.73 180 top
C28  166.15,14.79 180 top
C29  186.34,14.59 180 top
C30  181.15,14.79 180 top
C31  208,37.72 0 top
C32  214,37.72 0 top
C37  219.19,14.66 180 top
C38  na  [C0603]  213,14.71 180 top
PAD1  119,67.5 0 top
PAD2  119,70.5 0 top
PAD3  119,73.5 0 top
PAD4  119,76.5 0 top
PAD5  119,79.5 0 top
PAD6  119,82.5 0 top
PAD7  107,67.5 0 top
PAD8  107,70.5 0 top
PAD9  107,73.5 0 top
PAD10  107,76.5 0 top
PAD11  107,79.5 0 top
PAD12  107,82.5 0 top
PAD13  140,67.5 180 top
PAD14  140,70.5 180 top
PAD15  140,73.5 180 top
PAD16  140,76.5 180 top
PAD17  140,79.5 180 top
PAD18  140,82.5 180 top
PAD19  128,67.5 180 top
PAD20  128,70.5 180 top
PAD21  128,73.5 180 top
PAD22  128,76.5 180 top
PAD23  128,79.5 180 top
PAD24  128,82.5 180 top
PAD25  147,82.5 0 top
PAD26  147,79.5 0 top
PAD27  147,76.5 0 top
PAD28  147,73.5 0 top
PAD29  147,70.5 0 top
PAD30  147,67.5 0 top
PAD31  160,70.5 0 top
PAD32  160,67.5 0 top
PAD33  160,82.5 0 top
PAD34  160,79.5 0 top
PAD35  160,76.5 0 top
PAD36  160,73.5 0 top
PAD37  171.5,73.5 180 top
PAD38  171.5,76.5 180 top
PAD39  171.5,79.5 180 top
PAD40  171.5,82.5 180 top
PAD41  171.5,67.5 180 top
PAD42  171.5,70.5 180 top
PAD44  185.5,76.5 0 top
PAD45  185.5,82.5 0 top
PAD46  185.5,73.5 0 top
PAD47  185.5,79.5 0 top
PAD48  192.4,82.5 0 top
PAD49  197.85,82.5 0 top
PAD50  192.4,79.5 0 top
PAD51  197.85,79.5 0 top
PAD52  192.4,76.5 0 top
PAD53  197.85,76.5 0 top
PAD54  192.4,73.5 0 top
PAD55  197.85,73.5 0 top
PAD56  192.4,70.5 0 top
PAD57  197.85,70.5 0 top
PAD58  192.4,67.5 0 top
PAD59  197.85,67.5 0 top
R1  65.37,31.75 180 top
R2  105.11,31.73 180 top
R3  105.11,34.73 180 top
R4  112.11,31.73 180 top
R5  112.11,34.73 180 top
R6  124.61,31.73 180 top
R7  93.06,8.55 0 top
R8  65.37,34.76 180 top
R9  77.86,31.75 180 top
R10  77.86,34.76 180 top
R11  93.06,11.55 0 top
R12  71.86,31.75 180 top
R13  58.87,31.75 180 top
R14  58.87,34.76 180 top
R15  71.86,34.76 180 top
R16  84.36,31.75 180 top
R17  84.36,34.76 180 top
R18  90.86,31.75 180 top
R19  90.86,34.76 180 top
R20  79.06,8.71 0 top
R21  79.06,11.71 0 top
R22  72.86,8.76 0 top
R23  72.86,11.76 0 top
R24  124.61,34.73 180 top
R25  118.61,31.73 180 top
R26  118.61,34.73 180 top
R27  131.12,31.73 180 top
R28  131.12,34.73 180 top
R29  137.62,31.73 180 top
R30  137.62,34.73 180 top
R31  125.81,8.69 0 top
R32  87.86,8.76 0 top
R33  87.86,11.76 0 top
R34  125.81,11.69 0 top
R35  119.61,8.73 0 top
R36  119.61,11.73 0 top
R37  139.81,8.54 0 top
R38  139.81,11.54 0 top
R39  134.62,8.73 0 top
R40  134.62,11.73 0 top
R41  152.15,31.79 180 top
R42  152.15,34.78 180 top
R43  158.65,31.79 180 top
R44  158.65,34.78 180 top
R45  171.15,31.79 180 top
R46  171.15,34.78 180 top
R47  165.15,31.79 180 top
R48  165.15,34.78 180 top
R49  177.65,31.79 180 top
R50  177.65,34.78 180 top
R51  184.15,31.79 180 top
R52  184.15,34.78 180 top
R53  172.34,8.73 0 top
R54  172.34,11.73 0 top
R55  166.15,8.79 0 top
R56  166.15,11.79 0 top
R57  186.34,8.59 0 top
R58  186.34,11.59 0 top
R59  181.15,8.79 0 top
R60  181.15,11.79 0 top
R61  208,31.71 180 top
R62  208,34.72 180 top
R63  214,31.71 180 top
R64  214,34.72 180 top
R73  219.19,8.66 0 top
R74  219.19,11.66 0 top
R75  213,8.71 0 top
R76  213,11.71 0 top
U$9  CURRENT-LOGO-0.25"  [CURRENT-0.25"]  10.91,70.31 0 top
X1  62.87,11.76 270 top
X2  82.86,17.75 90 top
X3  82.86,20.25 90 top
X4  109.61,11.73 270 top
X5  129.62,17.73 90 top
X6  129.62,20.23 90 top
X7  156.15,11.79 270 top
X8  176.15,17.79 90 top
X9  176.15,20.29 90 top
X10  203,11.71 270 top
X11  223,17.71 90 top
X12  223,20.21 90 top
X13  15.88,11.82 270 top
X14  35.88,17.82 90 top
X15  35.88,20.32 90 top
X16  221,95 180 top
X17  18.25,90.75 180 top
X18  38.25,90.75 180 top
X19  57.75,90.75 180 top
X20  77.25,90.75 180 top
X21  97.25,90.75 180 top
X22  67.5,64.5 270 top

### Tracks (layer width: path | path; a pad name or v marks a point on that pad's centre or on a via)
3V3_MCN1  (via drill 0.61)
  Top 0.406: v85.4,42.8 81.5,38.9 81.5,24.9 78,21.4 78,21.1 77.9,21 77.9,20.3 X3.8 | v106.9,46.4 106.9,65.8 107,65.9 PAD7.1
  Bottom 0.406: v85.4,42.8 103.3,42.8 v106.9,46.4
3V3_MCN2  (via drill 0.61)
  Top 0.406: v118.8,7.4 118.8,8.7 R35.1 118.8,8.9 v118.8,10 | v124.9,7.4 125,7.5 125,8.6 R31.1 | v117,10 116.9,10.1 116.9,15.8 117.6,16.5 117.8,16.5 120.1,18.8 120.7,18.8 121.1,19.2 122.1,19.2 122.2,19.1 123,19.1 123.1,19.2 124.2,19.2 124.6,19.6 124.6,20.2 X6.8 124.6,20.4 124.6,20.9 124.8,21.1 124.8,21.4 125.1,21.7 125.1,22.1 127.9,24.9 127.9,65.8 128,65.9 PAD19.1
  Bottom 0.406: v118.8,7.4 v124.9,7.4 | v118.8,10 v117,10
3V3_MCN3  (via drill 0.61)
  Top 0.406: v167,29.9 167.3,29.6 167.3,25.2 170.4,22.1 170.4,22 171,21.4 171,21.1 171.1,21 171.1,20.3 X9.8 | v162.3,34.6 162.3,66.2 161.7,66.8 161.7,68.2 160.6,69.3 160.6,69.4 160.5,69.5 160,69.5 PAD31.1
  Bottom 0.406: v167,29.9 v162.3,34.6
3V3_RCTL  (via drill 0.61)
  Top 0.406: v216.1,39.4 216.8,38.7 216.8,22.5 217.3,22 217.3,21.9 217.8,21.4 217.8,21.2 218,21 218,20.3 X12.8 | v169,39.4 168.7,39.7 168.7,67.4 v168.8,67.5
  Bottom 0.406: v169,39.4 v216.1,39.4 | v168.8,67.5 PAD41.1
5V_MCN1  (via drill 0.61)
  Top 0.406: v80,22.1 80,21.1 79.9,21 79.9,20.3 X3.7 | v80.5,25.2 80.8,25.5 80.8,39.2 83.1,41.5 v83.1,41.8 | v105.9,44.1 105.9,46.7 106.2,47 106.2,64.4 104.3,66.3 v104.3,70.5
  Bottom 0.406: v80,22.1 80,24.7 v80.5,25.2 | v83.1,41.8 85.7,41.8 86,42.1 103.6,42.1 105.6,44.1 v105.9,44.1 | v104.3,70.5 PAD8.1
5V_MCN2  (via drill 0.61)
  Top 0.406: v127.5,23.2 127.5,22.1 126.8,21.4 126.8,21.2 126.6,21 126.6,20.3 X6.7 | v126.9,25.2 127.2,25.5 127.2,64.4 125.3,66.3 v125.3,70.5
  Bottom 0.406: v127.5,23.2 127.5,24.6 v126.9,25.2 | v125.3,70.5 PAD20.1
5V_MCN3  (via drill 0.61)
  Top 0.406: v162.7,67.5 168,62.2 168,26.5 172.4,22.1 172.4,22 173,21.4 173,21.1 173.1,21 173.1,20.3 X9.7
  Bottom 0.406: v162.7,67.5 PAD32.1
5V_RCTL  (via drill 0.61)
  Top 0.406: v217.1,40.2 217.1,39.4 217.5,39 217.5,23.8 219.3,22 219.3,21.9 219.8,21.4 219.8,21.2 220,21 220,20.3 X12.7 | v169.7,40.5 169.4,40.8 169.4,66.8 169.8,67.2 169.8,68.2 170.9,69.3 170.9,69.4 171,69.5 171.5,69.5 PAD42.1
  Bottom 0.406: v217.1,40.2 216.6,40.2 216.4,40.4 215.8,40.4 215.5,40.1 170.1,40.1 v169.7,40.5
12V  (via drill 0.61)
  Top 0.406: v58.6,28.7 59.2,28.1 59.2,14.1 58.7,13.6 v58.7,11.9 | v123.3,14.5 123.1,14.3 v123.1,11.9
  Bottom 0.406: v123.1,11.9 122.8,12.2 114.6,12.2 112,9.6 111.2,9.6 111.1,9.7 110.1,9.7 110,9.6 109.2,9.6 108.8,10 107.1,10 107,10.1 106.9,10.1 106.73,9.98
  pour Bottom: 0,0 242,0 242,100 0,100
ABS_EN  (via drill 0.61)
  Top 0.254: v211.9,10 212.1,9.8 212.1,8.8 R75.1 | v200.7,15.1 201,15.4 201,32.4 199.5,33.9 v199.5,42.2 | v179.7,42.5 180,42.8 180,67.4 v175.1,72.3
  Bottom 0.254: v211.9,10 206.8,15.1 v200.7,15.1 | v199.5,42.2 199.2,41.9 183,41.9 182.4,42.5 v179.7,42.5 | v175.1,72.3 173.7,72.3 172.7,73.3 172.6,73.3 172.4,73.5 PAD37.1
AIN2_RCTL  (via drill 0.61)
  Top 0.254: C32.1 213.1,37.7 213.1,34.8 R64.2 213.1,34.7 213.1,31.8 R63.2 213.1,31.6 v213.1,30.4 | v215.8,29.8 216.2,29.4 216.2,22.5 216,22.3 216,20.3 X12.9
  Bottom 0.254: v215.8,29.8 215.2,30.4 v213.1,30.4
AIN6_MCN2
  Top 0.254: C16.1 136.8,37.7 136.8,34.8 R30.2 136.8,34.7 136.8,31.8 R29.2 136.8,31.7 136.8,30.5 136.9,30.4 136.9,25.5 138.6,23.8 138.6,20.3 X6.1
AIN6_MCN3
  Top 0.254: C26.1 183.3,37.7 183.3,34.9 R52.2 183.3,34.7 R51.2 183.3,31.7 183.3,31.1 183.4,31 183.4,25.5 185.1,23.8 185.1,20.3 X9.1
AIN7_MCN1  (via drill 0.61)
  Top 0.254: R7.2 93.9,8.6 93.9,11.5 R11.2 93.9,11.6 93.9,14.5 C13.1 93.8,14.5 93.7,14.6 93.8,14.7 v93.8,15.8 | v91.9,16.3 91.9,17.7 X2.1
  Bottom 0.254: v91.9,16.3 92.4,15.8 v93.8,15.8
AIN7_MCN2  (via drill 0.61)
  Top 0.254: R37.2 140.7,8.6 140.7,11.5 R38.2 140.7,11.6 140.7,14.5 C19.1 140.6,14.6 v140.6,15.8 | v138.6,16.2 138.6,17.7 X5.1
  Bottom 0.254: v138.6,16.2 139,15.8 v140.6,15.8
AIN7_MCN3  (via drill 0.61)
  Top 0.254: R57.2 187.2,11.5 R58.2 187.2,11.7 187.2,14.5 C29.1 187.1,14.5 187,14.6 187.1,14.7 v187.1,15.8 | v185.1,16.3 185.1,17.7 X8.1
  Bottom 0.254: v185.1,16.3 185.6,15.8 v187.1,15.8
AIN8_MCN1  (via drill 0.61)
  Top 0.254: R32.2 88.7,8.8 88.7,11.7 R33.2 88.7,11.8 88.7,14.7 C14.1 88.8,14.7 88.9,14.8 88.8,14.9 v88.8,16 | v89.9,16.3 89.9,17.7 X2.2
  Bottom 0.254: v89.9,16.3 89.6,16 v88.8,16
AIN8_MCN2
  Top 0.254: R39.2 135.5,8.8 135.5,11.7 R40.2 135.5,11.8 135.5,14.7 C20.1 135.6,14.6 135.7,14.7 135.6,14.8 135.6,16 136.6,17 136.6,17.7 X5.2
AIN8_MCN3
  Top 0.254: R59.2 182,11.7 R60.2 182,11.9 182,14.7 C30.1 182.1,14.7 182.2,14.8 182.1,14.9 182.1,16 182.2,16.1 182.2,16.2 183.1,17.1 183.1,17.7 X8.2
CAN2_H  (via drill 0.61)
  Top 0.254: v174.2,73.2 174.2,65.2 v171.8,62.8 | v155.7,62.8 155.4,62.5 155.4,35.5 155.7,35.2 155.7,15.2 154.4,13.9 154.4,13.4 154.1,13.1 154.1,12.8 X7.5 | 108.45,14.45 109.1,15.1 110.1,15.1 110.9,14.3 v110.9,14.2 | 108.45,14.45 107.6,13.6 107.6,12.8 X4.5 | X22.4 67.5,64.1 66.5,65.1 66.5,65.9 66,66.4 66,67.1 58.6,74.5 58.6,83.6 55.8,86.4 55.8,86.7 55.2,87.3 54.8,87.3 54.8,87.7 X19.4 | X22.4 | v67.5,61.7 67.5,63.4 X22.4 | v69.4,61.5 69.1,61.2 69.1,26.9 | 69.1,26.9 69.1,14.9 v69.4,14.6 | v107.4,22.9 108.4,21.9 108.4,14.5 108.45,14.45 | v69.4,26.9 69.1,26.9
  Bottom 0.254: X17.4 15.3,87.8 15.6,87.8 15.6,87.3 15.7,87.2 15.8,87.2 17.2,85.8 22,85.8 24,87.8 35.2,87.8 X18.4 35.3,87.8 35.6,87.8 35.6,87.3 35.7,87.2 35.8,87.2 37.2,85.8 42,85.8 44,87.8 54.7,87.8 X19.4 | X13.5 13.9,12.9 13.9,13.4 15.1,14.6 19,14.6 20.8,12.8 58.9,12.8 59,12.9 59.2,12.9 59.3,12.8 60.8,12.8 X1.5 60.9,12.8 61,12.8 61,13.2 61.1,13.3 61.1,13.5 62.2,14.6 v69.4,14.6 | PAD45.1 183.5,82.5 v174.2,73.2 | v171.8,62.8 v155.7,62.8 | v110.9,14.2 111.2,14.5 112.9,14.5 114.6,12.8 140.9,12.8 141.7,13.6 152.1,13.6 152.9,12.8 154.1,12.8 X7.5 | v67.5,61.7 67.7,61.5 v69.4,61.5 | v107.4,22.9 85.1,22.9 81.1,26.9 v69.4,26.9
CAN2_L  (via drill 0.61)
  Top 0.254: v181.2,77.2 v181.2,29.6 | v156.6,28.7 156.3,28.4 156.3,20.8 | 156.3,20.8 156.3,14.4 156.1,14.2 156.1,12.8 X7.3 | X22.3 67.5,66.3 67.2,66.6 67.2,66.7 59.2,74.7 59.2,86.3 58.2,87.3 57.8,87.3 57.8,87.7 X19.5 | X22.3 | v109.6,14.2 109.6,12.8 X4.3 | v68.5,13.3 68.5,63.9 67.5,64.9 67.5,65.4 X22.3 | v137.7,21.9 137.5,22.1 v137.5,23.7 | v130.1,24.5 130,24.6 v130,26.9 | v120.9,26.9 121.2,26.6 121.2,22.4 v120.8,22 | v106.5,22 106.2,21.7 106.2,14 v106.5,13.7 | 156.3,20.8 v156.6,20.8
  Bottom 0.254: X17.5 18.3,87.8 18.6,87.8 18.6,88.2 18.7,88.3 18.8,88.3 19.6,89.1 20.3,89.1 20.4,89 20.6,89 20.7,88.9 21.8,88.9 21.9,89 22.1,89 22.2,89.1 22.6,89.1 22.7,89 33.9,89 34.1,88.8 34.7,88.8 34.8,88.9 35.7,88.9 35.9,88.7 36.6,88.7 36.7,88.6 36.8,88.6 37.2,88.2 37.3,88.2 37.7,87.8 38.2,87.8 X18.5 38.3,87.8 38.6,87.8 38.6,88.2 38.7,88.3 38.8,88.3 39.6,89.1 40.3,89.1 40.4,89 40.6,89 40.7,88.9 41.8,88.9 41.9,89 42.1,89 42.2,89.1 42.6,89.1 42.7,89 53.4,89 53.6,88.8 54.2,88.8 54.3,88.9 55.2,88.9 55.4,88.7 56.1,88.7 56.2,88.6 56.3,88.6 56.7,88.2 56.8,88.2 57.2,87.8 57.7,87.8 X19.5 | PAD47.1 183.5,79.5 v181.2,77.2 | v181.2,29.6 180.9,29.9 177.5,29.9 176.3,28.7 v156.6,28.7 | 65.9,13.2 65.9,11.9 65.6,11.6 65.6,11.5 65.9,11.2 65.9,10.3 65.3,9.7 64.4,9.7 64.2,9.5 22.3,9.5 18.9,12.9 18.9,13.6 18.6,13.9 17.1,13.9 16,12.8 15.9,12.8 X13.3 | 65.9,13.2 65.9,13.5 65.6,13.8 64.1,13.8 63.8,13.5 63.8,13.4 63.2,12.8 62.9,12.8 X1.3 | v109.6,14.2 109.3,14.5 106.9,14.5 106.15,13.75 | 106.15,13.75 105.2,12.8 75.3,12.8 74.9,13.2 68.5,13.2 | 68.5,13.2 65.9,13.2 | 68.5,13.2 v68.5,13.3 | v156.6,20.8 142,20.8 140.6,22.2 138,22.2 v137.7,21.9 | v137.5,23.7 136.7,24.5 v130.1,24.5 | v130,26.9 v120.9,26.9 | v120.8,22 v106.5,22 | v106.5,13.7 106.2,13.7 106.15,13.75
CANA_H  (via drill 0.61)
  Top 0.254: v199.2,63.7 199.6,63.7 201.6,61.7 201.6,14.8 201,14.2 201,12.8 X10.5 | v187.3,67.4 187.3,69.5 185.5,71.3 PAD46.1 | v104.4,86.7 v104.4,84.9 | v176.2,85.8 176.2,78.3 179.4,75.1 v179.8,75.1 | v72.3,65.1 72.3,85.1 73.15,85.95 | 73.15,85.95 73.8,86.6 73.8,86.7 74.3,87.2 74.3,87.7 X20.4 | v73.2,85.9 73.15,85.95
  Bottom 0.254: v199.2,63.7 198.5,64.4 191.3,64.4 188.3,67.4 v187.3,67.4 | v104.4,84.9 104.1,85.2 96.9,85.2 95.5,86.6 95.4,86.6 X21.4 94.6,87.3 93.9,87.3 93.8,87.2 93.7,87.2 92.3,85.8 73.3,85.8 v73.2,85.9 | v104.4,86.7 104.7,86.4 106.2,86.4 106.5,86.1 115,86.1 115.6,85.5 175.9,85.5 v176.2,85.8 | v179.8,75.1 183.1,75.1 184.7,73.5 PAD46.1 | X22.2 70.7,63.5 v72.3,65.1 | X22.2
CANA_L  (via drill 0.61)
  Top 0.254: v199.1,65 202.2,61.9 202.2,14.4 203,13.6 203,12.8 X10.3 | v188.2,76.5 v188.2,68.3 | v178.2,83.2 178.2,82.2 182.7,77.7 182.7,76.7 v182.9,76.5 | v71.4,66 71.7,66.3 71.7,84.6 v71.4,84.9 | v76.1,84.9 76.1,85.9 76.8,86.6 76.8,86.7 77.3,87.2 77.3,87.7 X20.5
  Bottom 0.254: X20.5 77.3,87.8 77.6,87.8 77.6,88.2 77.7,88.3 77.8,88.3 78.6,89.1 79.3,89.1 79.4,89 79.6,89 79.7,88.9 80.8,88.9 80.9,89 81.1,89 81.2,89.1 81.6,89.1 81.7,89 92.9,89 93.1,88.8 93.7,88.8 93.8,88.9 94.7,88.9 94.9,88.7 95.6,88.7 95.7,88.6 95.8,88.6 96.2,88.2 96.3,88.2 96.7,87.8 97.2,87.8 X21.5 98.4,86.6 98.5,86.6 99.3,85.8 106,85.8 106.3,85.5 114.8,85.5 115.4,84.9 176.5,84.9 v178.2,83.2 | v199.1,65 191.5,65 v188.2,68.3 | v188.2,76.5 PAD44.1 v182.9,76.5 | X22.1 70.9,65.5 v71.4,66 | v76.1,84.9 v71.4,84.9 | X22.1
FLEX1  (via drill 0.61)
  Top 0.254: v172,33.1 R45.1 | v160.8,39.1 161.1,39.4 161.1,62.6 157.3,66.4 v157.3,79.5
  Bottom 0.254: v172,33.1 166,39.1 v160.8,39.1 | v157.3,79.5 PAD34.1
FLEX1_MCN3  (via drill 0.61)
  Top 0.254: C23.1 170.3,37.7 170.3,34.9 R46.2 170.3,34.7 R45.2 170.3,31.7 170.3,31.1 170.4,31 v170.4,30.5 | v173.7,30.5 173.7,22.6 175.1,21.2 175.1,20.3 X9.6
  Bottom 0.254: v173.7,30.5 v170.4,30.5
FLEX2  (via drill 0.61)
  Top 0.254: v166,33.1 R47.1 | v156.3,39.1 156,39.4 156,61.9 156.7,62.6 156.7,78.9 156.4,79.2 156.4,81.6 v157.3,82.5
  Bottom 0.254: v166,33.1 160.9,38.2 157.2,38.2 v156.3,39.1 | v157.3,82.5 PAD33.1
FLEX2_MCN3  (via drill 0.61)
  Top 0.254: C24.1 164.3,37.7 164.3,34.9 R48.2 164.3,34.7 R47.2 164.3,31.7 164.3,31.1 164.4,31 164.4,30 166.1,28.3 v166.1,23 | v176.4,21.9 177.1,21.2 177.1,20.3 X9.5
  Bottom 0.254: v176.4,21.9 175.3,23 v166.1,23
FLEX3  (via drill 0.61)
  Top 0.254: v178.5,33.1 R49.1 | v173.8,37.8 173.8,38.8 170,42.6 170,64.5 v170.4,64.9 | v164,67.5 163.2,68.3 163.2,76 v162.7,76.5
  Bottom 0.254: v178.5,33.1 v173.8,37.8 | v170.4,64.9 168.7,66.6 164.9,66.6 v164,67.5 | v162.7,76.5 PAD35.1
FLEX3_MCN3  (via drill 0.61)
  Top 0.254: C25.1 176.8,37.7 176.8,34.9 R50.2 176.8,34.7 R49.2 176.8,31.7 176.8,31.1 176.9,31 v176.9,30.5 | v182.5,29.9 182.8,29.6 182.8,22.4 183.1,22.1 183.1,20.3 X9.2
  Bottom 0.254: v182.5,29.9 181.9,30.5 v176.9,30.5
FLOW_MCTLLOOP_MCN2  (via drill 0.61)
  Top 0.254: R31.2 126.7,8.7 126.7,11.6 R34.2 126.7,11.8 126.7,14.6 C17.1 126.8,14.6 126.8,16.1 126.6,16.3 126.6,17.7 X5.7 | v134.8,47 v134.8,67.3 | v134.8,44.6 134.5,44.3 134.5,23.4 133.6,22.5 v133.6,22
  Bottom 0.254: PAD14.1 138,70.5 v134.8,67.3 | v134.8,44.6 v134.8,47 | v133.6,22 128.9,22 127.6,20.7 127.6,19.8 127.1,19.3 127.1,18.8 127,18.7 127,18.5 126.7,18.2 126.7,17.8 X5.7
FLOW_MTRLOOP_MCN2  (via drill 0.61)
  Top 0.254: R35.2 120.5,8.8 120.5,11.7 R36.2 120.5,11.8 120.5,14.7 C18.1 120.6,14.7 121.2,14.7 v121.8,15.3 | v124,16.3 124.6,16.9 124.6,17.7 X5.8 124.6,17.8 124.6,18.7 124.9,19 130.8,19 131.6,19.8 131.6,20.7 131.7,20.8 131.7,20.9 132.1,21.3 132.1,21.8 133.9,23.6 133.9,44.9 140,51 PAD13.1
  Bottom 0.254: v124,16.3 123,15.3 v121.8,15.3
GND  (via drill 0.61)
  Top 0.406: C21.2 152.8,37.8 152.5,37.8 152.5,39.4 v151.8,40.1 151.5,40.1 149.9,38.5 149.9,33.4 v150.2,33.1
  Bottom 0.406: v125.7,51.4 v131.8,51.4 v140.9,51.4 140.9,51.6 142,52.7 152,52.7 | 152,52.7 v156.9,52.7 v163.8,52.7 | v199.6,13.1 199.5,13.2 v186,13.2 | v184.5,27.4 184.4,27.3 176.1,27.3 175.3,28.1 164.9,28.1 v164.6,27.8 | v151.8,40.1 151.6,40.3 151.6,41.2 152,41.6 152,52.7 | v150.2,33.1 141.2,33.1 139.4,31.3 136.8,31.3 136.3,31.8 135.2,31.8 134.4,31 131.8,31 130.5,32.3 130.5,35.4 130.6,35.5 130.6,36.7 129.6,37.7 127.3,37.7 v126,36.4 | v141.7,16.5 142.1,16.1 142.2,16.1 142.3,16 142.3,15.1 140.6,13.4 121.3,13.4 119.6,15.1 v119.6,15.9
  pour Top (isolate 0.406): 0,0 242,0 242,100 0,100
GP0_MCN1
  Top 0.254: R20.2 79.9,8.8 R21.2 79.9,11.8 C7.1 79.8,14.6 79.7,14.7 79.8,14.8 79.8,16 79.9,16.1 79.9,17.7 X2.7
GP0_MCN3
  Top 0.254: R53.2 173.2,8.8 173.2,9.4 173.1,9.5 173.1,10.3 173.2,10.4 173.2,11.7 R54.2 173.2,11.8 173.2,14.7 C27.1 173.1,14.8 173.1,17.7 X8.7
GP1_MCN1  (via drill 0.61)
  Top 0.254: R22.2 73.7,8.8 73.7,11.7 R23.2 73.7,11.8 73.7,14.7 C8.1 73.8,14.8 74.6,14.8 v75,15.2 | v77.9,16.3 77.9,17.7 X2.8
  Bottom 0.254: v77.9,16.3 76.8,15.2 v75,15.2
GP1_MCN3  (via drill 0.61)
  Top 0.254: R55.2 167,11.7 R56.2 167,11.9 167,14.7 C28.1 167.1,14.7 167.2,14.8 167.1,14.9 v167.1,16 | v170.6,16.4 171.1,16.9 171.1,17.7 X8.8
  Bottom 0.254: v170.6,16.4 170.4,16.2 169.9,16.2 169.7,16 v167.1,16
GP1_MCN4  (via drill 0.61)
  Top 0.254: R75.2 213.8,8.8 213.8,11.7 R76.2 213.8,11.8 213.8,14.7 C38.1 213.9,14.7 214.6,14.7 v215.2,15.3 | v217.8,16.3 217.8,16.7 218,16.9 X11.8
  Bottom 0.254: v217.8,16.3 216.8,15.3 v215.2,15.3
PRES_AMB  (via drill 0.61)
  Top 0.254: v85.1,33.1 85.2,33 85.2,31.8 R16.1 | v87,35 v87,41.1 | v106.8,43.2 106.8,45.1 107.8,46.1 107.8,46.7 107.5,47 107.5,64.3 109.7,66.5 v109.7,79.5
  Bottom 0.254: v85.1,33.1 v87,35 | v87,41.1 87.4,41.5 103.9,41.5 105.6,43.2 v106.8,43.2 | v109.7,79.5 PAD11.1
PRES_AMB_MCN1  (via drill 0.61)
  Top 0.254: C5.1 83.5,37.7 83.5,34.8 R17.2 83.5,34.7 83.5,31.8 R16.2 83.5,31.7 83.5,31 83.6,30.9 83.6,30.5 v83.7,30.4 | v89.1,29.9 89.4,29.6 89.4,25.5 89.9,25 89.9,20.3 X3.2
  Bottom 0.254: v89.1,29.9 88.6,30.4 v83.7,30.4
PRES_MTR_IN  (via drill 0.61)
  Top 0.254: v91.6,33.1 91.7,33 91.7,31.8 R18.1 | v93.5,35 v93.5,40 | v108.6,41.4 108.6,45.3 109,45.7 109,47.1 108.7,47.4 108.7,63.9 110.9,66.1 110.9,75.6 111.5,76.2 111.5,80.7 v109.7,82.5
  Bottom 0.254: v91.6,33.1 v93.5,35 | v93.5,40 93.8,40.3 104.3,40.3 105.4,41.4 v108.6,41.4 | v109.7,82.5 PAD12.1
PRES_MTR_IN_MCN1
  Top 0.254: C6.1 90,37.7 90,34.8 R19.2 90,34.7 90,31.8 R18.2 90,31.7 90,25.7 91.9,23.8 91.9,20.3 X3.1
STEER_ANG  (via drill 0.61)
  Top 0.254: v78.6,33.1 78.7,33 78.7,31.8 R9.1 | v107.7,42.3 107.7,45.2 108.4,45.9 108.4,46.9 108.1,47.2 108.1,64.1 110.3,66.3 110.3,76.2 v110.6,76.5
  Bottom 0.254: v78.6,33.1 85.7,40.2 87.3,40.2 88,40.9 104.1,40.9 105.5,42.3 v107.7,42.3 | v110.6,76.5 PAD10.1
STEER_ANG_MCN1  (via drill 0.61)
  Top 0.254: C3.1 77,37.7 77,34.8 R10.2 77,34.7 77,31.8 R9.2 77,31.7 v77,30.4 | v82.5,29.9 82.1,29.5 82.1,24.6 81.9,24.4 81.9,20.3 X3.6
  Bottom 0.254: v82.5,29.9 82,30.4 v77,30.4
SUSP_FRNT  (via drill 0.61)
  Top 0.254: v61,31.3 60.5,31.8 59.8,31.8 R13.1 | v114,39.2 114.3,39.5 114.3,66.6 113.7,67.2 v113.7,68.9 | v113.7,72.1 113.7,76.9 v116.3,79.5
  Bottom 0.254: v61,31.3 64.8,31.3 65.1,31 73.8,31 74.1,31.3 77.3,31.3 77.6,31 83.1,31 83.4,31.3 84,31.3 84.3,31 103.7,31 104.8,32.1 106.9,32.1 v114,39.2 | v113.7,68.9 v113.7,72.1 | v116.3,79.5 PAD5.1
SUSP_FRNT_MCN1  (via drill 0.61)
  Top 0.254: C1.1 58,37.7 58,34.8 R14.2 58,34.7 58,31.8 R13.2 58,31.7 v58,30.4 | v73.5,28.6 73.8,28.3 73.8,22.4 73.9,22.3 73.9,20.3 X3.10
  Bottom 0.254: v73.5,28.6 73.4,28.7 71.4,28.7 71.3,28.6 70.7,28.6 69.5,29.8 65.1,29.8 64.8,29.5 58.9,29.5 v58,30.4
SUSP_REAR  (via drill 0.61)
  Top 0.254: v66.1,33.1 66.2,33 66.2,31.8 R1.1 | v74.2,36.5 74.5,36.8 74.5,69.1 v74.2,69.4 | v104.5,71.8 104.3,72 104.3,83.5 v105.7,84.9
  Bottom 0.254: v66.1,33.1 69.5,36.5 v74.2,36.5 | v74.2,69.4 74.9,70.1 76.1,70.1 77.7,71.7 104.4,71.7 v104.5,71.8 | v105.7,84.9 114.6,84.9 117,82.5 PAD6.1
SUSP_REAR_MCN1  (via drill 0.61)
  Top 0.254: C2.1 64.5,37.7 64.5,34.8 R8.2 64.5,34.7 64.5,31.8 R1.2 64.5,31.7 v64.5,30.4 | v74.4,30.4 74.4,22.6 75.9,21.1 75.9,20.3 X3.9
  Bottom 0.254: v64.5,30.4 v74.4,30.4
TEMP_AMB  (via drill 0.61)
  Top 0.254: v72.6,33.1 72.7,33 72.7,31.8 R12.1 | v75.1,35.6 75.1,70.3 v75.8,71
  Bottom 0.254: v72.6,33.1 v75.1,35.6 | v75.8,71 77.1,72.3 103.8,72.3 105,73.5 PAD9.1
TEMP_AMB_MCN1  (via drill 0.61)
  Top 0.254: C4.1 71,37.7 71,34.8 R15.2 71,34.7 71,31.8 R12.2 71,31.7 v71,29.5 | v83.3,28.9 83.3,22.2 83.9,21.6 83.9,20.3 X3.5
  Bottom 0.254: v83.3,28.9 83.2,29 82.2,29 81.4,29.8 77.6,29.8 77.3,29.5 v71,29.5
TEMP_CLNT_MCTL_IN  (via drill 0.61)
  Top 0.254: v125.7,33 125.5,32.8 125.5,31.8 R6.1 | v128.9,36 128.7,36.2 128.7,36.3 128.5,36.5 128.5,64.3 130.7,66.5 v130.7,76.5
  Bottom 0.254: v125.7,33 128.7,36 v128.9,36 | v130.7,76.5 PAD22.1
TEMP_CLNT_MCTL_IN_MCN2  (via drill 0.61)
  Top 0.254: C11.1 123.8,37.7 123.8,34.8 R24.2 123.8,34.7 123.8,31.8 R6.2 123.8,31.7 v123.8,30.4 | v128.9,30.1 128.5,29.7 128.5,24.9 128.6,24.8 128.6,20.3 X6.6
  Bottom 0.254: v128.9,30.1 128.6,30.4 v123.8,30.4
TEMP_CLNT_MCTL_OUT  (via drill 0.61)
  Top 0.254: v119.7,33 119.5,32.8 119.5,31.8 R25.1 | v126.2,39.3 126.6,39.7 126.6,64.1 124.7,66 124.7,69.9 124.4,70.2 124.4,72.6 v125.3,73.5
  Bottom 0.254: v119.7,33 126,39.3 v126.2,39.3 | v125.3,73.5 PAD21.1
TEMP_CLNT_MCTL_OUT_MCN2  (via drill 0.61)
  Top 0.254: C12.1 117.8,37.7 117.8,34.8 R26.2 117.8,34.7 117.8,31.8 R25.2 117.8,31.7 117.8,30.5 117.9,30.4 v117.9,29.5 | v129.4,28.9 129.1,28.6 129.1,25.1 129.2,25 129.2,22.6 129.8,22 129.8,21.9 130.6,21.1 130.6,20.3 X6.5
  Bottom 0.254: v129.4,28.9 129.1,29.2 118.2,29.2 v117.9,29.5
TEMP_CLNT_MTR_IN  (via drill 0.61)
  Top 0.254: v106.2,33 106,32.8 106,31.8 R2.1 | v131.2,42 130.9,42.3 130.9,63.5 133.1,65.7 133.1,75.3 133.4,75.6 133.4,77.8 135.1,79.5 v135.5,79.5
  Bottom 0.254: v106.2,33 114.6,41.4 130,41.4 130.6,42 v131.2,42 | v135.5,79.5 PAD17.1
TEMP_CLNT_MTR_IN_MCN2  (via drill 0.61)
  Top 0.254: C9.1 104.3,37.7 104.3,34.8 R3.2 104.3,34.7 104.3,31.8 R2.2 104.3,31.7 v104.3,30.4 | v119.6,28.3 119.6,22 120.6,21 120.6,20.3 X6.10
  Bottom 0.254: v119.6,28.3 119.3,28.6 117.6,28.6 116.4,29.8 111.9,29.8 111.6,29.5 105.2,29.5 v104.3,30.4
TEMP_CLNT_MTR_OUT  (via drill 0.61)
  Top 0.254: v113.2,33 113,32.8 113,31.8 R4.1 | v130.6,40.8 130.3,41.1 130.3,63.7 132.5,65.9 132.5,75.5 132.8,75.8 132.8,78 v137.3,82.5
  Bottom 0.254: v113.2,33 121,40.8 v130.6,40.8 | v137.3,82.5 PAD18.1
TEMP_CLNT_MTR_OUT_MCN2  (via drill 0.61)
  Top 0.254: C10.1 111.3,37.7 111.3,34.8 R5.2 111.3,34.7 111.3,31.8 R4.2 111.3,31.7 v111.3,30.4 | v121.1,30.4 121.8,29.7 121.8,21.9 122.6,21.1 122.6,20.3 X6.9
  Bottom 0.254: v121.1,30.4 v111.3,30.4
TEMP_CONTACTOR_BOX  (via drill 0.61)
  Top 0.254: v132.2,33 132,32.8 132,31.8 R27.1 | v129.4,39.5 129.1,39.8 129.1,64.1 131.3,66.3 131.3,75.9 131.6,76.2 131.6,78.6 v130.7,79.5
  Bottom 0.254: v132.2,33 132.2,36.7 v129.4,39.5 | v130.7,79.5 PAD23.1
TEMP_CONTACTOR_BOX_MCN2  (via drill 0.61)
  Top 0.254: C15.1 130.3,37.7 130.3,34.8 R28.2 130.3,34.7 130.3,31.8 R27.2 130.3,31.7 v130.3,30.4 | v136,29.8 136.3,29.5 136.3,25.3 136.6,25 136.6,20.3 X6.2
  Bottom 0.254: v136,29.8 135.4,30.4 v130.3,30.4
TEMP_TIRE_FRNT  (via drill 0.61)
  Top 0.254: v153,33.1 R41.1 | v154.8,34.9 v154.8,64.2 | v149.7,65.6 v149.7,70.5
  Bottom 0.254: v153,33.1 v154.8,34.9 | v154.8,64.2 154.5,64.5 151.2,64.5 150.1,65.6 v149.7,65.6 | v149.7,70.5 PAD29.1
TEMP_TIRE_FRNT_MCN3  (via drill 0.61)
  Top 0.254: C21.1 151.3,37.7 151.3,34.9 R42.2 151.3,34.7 R41.2 151.3,31.7 151.3,31.1 151.4,31 v151.4,30.5 | v163.6,29.6 164,29.6 165.5,28.1 165.5,23.6 165.2,23.3 165.2,22.6 167.1,20.7 167.1,20.3 X9.10
  Bottom 0.254: v163.6,29.6 163.3,29.9 158.5,29.9 158.2,29.6 152.3,29.6 v151.4,30.5
TEMP_TIRE_REAR  (via drill 0.61)
  Top 0.254: v159.5,33.1 R43.1 | v161.4,33.7 161.4,34.9 161.7,35.2 161.7,64.7 v161.3,65.1
  Bottom 0.254: v159.5,33.1 160.1,33.7 v161.4,33.7 | v161.3,65.1 151.4,65.1 149,67.5 PAD30.1
TEMP_TIRE_REAR_MCN3  (via drill 0.61)
  Top 0.254: C22.1 157.8,37.7 157.8,34.9 R44.2 157.8,34.7 R43.2 157.8,31.7 157.8,31.1 157.9,31 v157.9,30.5 | v165.7,29.9 166.7,28.9 166.7,23.6 169.1,21.2 169.1,20.3 X9.9
  Bottom 0.254: v165.7,29.9 165.1,30.5 v157.9,30.5
THRTL_EN  (via drill 0.61)
  Top 0.254: v218.2,10 218.3,9.9 218.3,8.7 R73.1 | v200.1,16.3 200.4,16.6 200.4,32.2 198.9,33.7 198.9,41.6 198.3,42.2 v198.3,42.8 | v182.7,43.3 182.4,43.6 182.4,73.9 v182.7,74.2 | v176.4,74.2 174.2,76.4 v174.2,76.5
  Bottom 0.254: v218.2,10 212.5,15.7 201.3,15.7 200.7,16.3 v200.1,16.3 | v198.3,42.8 198,42.5 183.5,42.5 v182.7,43.3 | v182.7,74.2 v176.4,74.2 | v174.2,76.5 PAD38.1
THRTL_EN_RCTL
  Top 0.254: R73.2 220,8.7 220,11.6 R74.2 220,11.7 220,14.6 C37.1 219.9,14.6 219.9,15.9 220,16 X11.7
THRTL_POS  (via drill 0.61)
  Top 0.254: v208.8,33 208.8,31.8 R61.1 | v203.1,33 202.8,33.3 202.8,40.8 v203.1,41.1 | v180.3,41.1 180.6,41.4 180.6,73.1 v174.2,79.5
  Bottom 0.254: v203.1,33 v208.8,33 | v203.1,41.1 202.7,40.7 180.7,40.7 v180.3,41.1 | v174.2,79.5 PAD39.1
THRTL_POS_RCTL  (via drill 0.61)
  Top 0.254: C31.1 207.1,37.7 207.1,34.8 R62.2 207.1,34.7 207.1,31.8 R61.2 207.1,31.6 v207.1,30.4 | v213,29.1 213,22 214,21 214,20.3 X12.10
  Bottom 0.254: v213,29.1 212.3,29.8 207.7,29.8 v207.1,30.4
UNUSED_A1  (via drill 0.61)
  Top 0.254: v92.1,9.9 92.2,9.8 92.2,8.6 R7.1 | v103.7,11.3 104,11.6 104,12.2 105,13.2 105,25.3 108.7,29 108.7,39.8 v108.4,40.1 | v110.2,40.6 110.2,47.5 109.9,47.8 109.9,63.5 112.1,65.7 112.1,68.5 116.1,72.5 116.5,72.5 117.2,73.2 117.2,74 118.5,75.3 118.6,75.3 119,75.7 PAD4.1
  Bottom 0.254: v92.1,9.9 93.8,11.6 103.4,11.6 v103.7,11.3 | v108.4,40.1 108.8,40.5 110.1,40.5 v110.2,40.6
UNUSED_A2  (via drill 0.61)
  Top 0.254: v86.9,10.1 87,10 87,8.8 R32.1 | v104.9,11.9 105.6,12.6 105.6,25.1 109.3,28.8 109.3,40.9 109.6,41.2 109.6,47.3 109.3,47.6 109.3,63.7 111.5,65.9 111.5,68.7 v116.3,73.5
  Bottom 0.254: v86.9,10.1 89,12.2 104.6,12.2 v104.9,11.9 | v116.3,73.5 PAD3.1
UNUSED_A3  (via drill 0.61)
  Top 0.254: v138.7,33 138.5,32.8 138.5,31.8 R29.1 | v130.7,39.5 129.7,40.5 129.7,63.9 131.9,66.1 131.9,75.7 132.2,76 132.2,78.8 131.6,79.4 131.6,81.6 v130.7,82.5
  Bottom 0.254: v138.7,33 132.2,39.5 v130.7,39.5 | v130.7,82.5 PAD24.1
UNUSED_A4  (via drill 0.61)
  Top 0.254: v139.1,9.8 139,9.7 139,8.6 R37.1 | v143.5,11 143.5,12.2 143.2,12.5 143.2,21.9 144.4,23.1 144.4,24.4 144.3,24.5 144.3,25.2 144.5,25.4 144.5,25.7 144.7,25.9 144.7,27.7 144.4,28 144.4,28.1 144.3,28.2 144.3,29.4 144.4,29.5 144.4,44.4 144.3,44.5 144.3,45.2 144.5,45.4 144.5,45.7 144.7,45.9 v144.7,48.3 | v142.7,51 v142.7,76.5
  Bottom 0.254: v139.1,9.8 140.3,11 v143.5,11 | v144.7,48.3 144.7,49 v142.7,51 | v142.7,76.5 PAD16.1
UNUSED_A5  (via drill 0.61)
  Top 0.254: v133.9,10 133.8,9.9 133.8,8.8 R39.1 | v142.6,11.9 v142.6,22.5 | v135.1,22.8 135.1,43.7 135.7,44.3 v135.7,45.5 | v135.7,47.9 135.4,48.2 135.4,66.7 137.3,68.6 v137.3,73.5
  Bottom 0.254: v133.9,10 136.1,12.2 142.3,12.2 v142.6,11.9 | v142.6,22.5 142.3,22.8 v135.1,22.8 | v135.7,45.5 v135.7,47.9 | v137.3,73.5 PAD15.1
UNUSED_A6  (via drill 0.61)
  Top 0.254: v185,33.1 R51.1 | v175.1,37.7 174.4,38.4 174.4,39 170.6,42.8 170.6,63.4 v170.9,63.7 | v167.5,64 167.1,64 164.9,66.2 164.9,67.8 163.8,68.9 163.8,73.2 v164.1,73.5
  Bottom 0.254: v185,33.1 180.4,37.7 v175.1,37.7 | v170.9,63.7 170.6,64 v167.5,64 | v164.1,73.5 PAD36.1
UNUSED_A7  (via drill 0.61)
  Top 0.254: v184.2,8.2 184.3,8.2 184.7,8.6 185.4,8.6 R57.1 | v162.3,12.5 162.3,14.9 162,15.2 162,31.6 162.4,32 162.4,33.4 163.2,34.2 163.2,35.3 162.9,35.6 162.9,65.2 v163.3,65.6 | v151.5,67.5 151.2,67.8 151.2,73.2 v151.5,73.5
  Bottom 0.254: v184.2,8.2 178.7,8.2 178.4,8.5 166.7,8.5 162.7,12.5 v162.3,12.5 | v163.3,65.6 163,65.9 161.7,65.9 161.6,66 160.8,66 160.6,65.8 159.3,65.8 159.2,65.7 153.3,65.7 v151.5,67.5 | v151.5,73.5 PAD28.1
UNUSED_A8  (via drill 0.61)
  Top 0.254: v179,9.1 179.2,8.9 179.4,8.9 179.5,8.8 180.2,8.8 R59.1 | v161.4,14.6 v161.4,32.2 | v153.3,40.5 153.6,40.8 153.6,63 v153,63.6 | v143.6,63.9 143.3,64.2 143.3,75.5 v144.3,76.5
  Bottom 0.254: v179,9.1 166.9,9.1 v161.4,14.6 | v161.4,32.2 159.2,32.2 156.3,35.1 156.3,37.7 154.8,39.2 154.8,39.6 153.9,40.5 v153.3,40.5 | v153,63.6 152.7,63.9 v143.6,63.9 | v144.3,76.5 PAD27.1
UNUSED_A9  (via drill 0.61)
  Top 0.254: v214.8,33 214.8,31.8 R63.1 | v200.7,33.9 201,34.2 201,41.3 v200.7,41.6 | v182.1,41.6 181.8,41.9 181.8,76.6 182.1,76.9 182.1,77.5 v177.1,82.5
  Bottom 0.254: v214.8,33 213.9,33.9 208.5,33.9 208.2,33.6 203.7,33.6 203.4,33.9 v200.7,33.9 | v200.7,41.6 200.4,41.3 182.4,41.3 v182.1,41.6 | v177.1,82.5 PAD40.1
UNUSED_GP1  (via drill 0.61)
  Top 0.254: v78.2,7.4 78.2,8.7 R20.1 | v115.5,8 115.5,69.7 v116.3,70.5
  Bottom 0.254: v78.2,7.4 79.1,8.3 107.7,8.3 107.9,8.1 108.5,8.1 108.7,8.3 115.2,8.3 v115.5,8 | v116.3,70.5 PAD2.1
UNUSED_GP2  (via drill 0.61)
  Top 0.254: v71.9,10.1 72,10 72,8.8 R22.1 | v75.6,11.9 v75.6,13.7 | v114.6,15.1 114.9,15.4 114.9,67.2 v114.6,67.5
  Bottom 0.254: v71.9,10.1 73.7,11.9 v75.6,11.9 | v75.6,13.7 75.9,13.4 105,13.4 106.7,15.1 v114.6,15.1 | v114.6,67.5 PAD1.1
UNUSED_GP3  (via drill 0.61)
  Top 0.254: v171.2,10 171.5,9.7 171.5,8.8 R53.1 | v154.8,15.5 155.1,15.8 155.1,33.3 v154.8,33.6 | v153.9,39.3 154.2,39.6 154.2,63.6 150.6,67.2 150.6,78.6 v149.7,79.5
  Bottom 0.254: v171.2,10 165.7,15.5 v154.8,15.5 | v154.8,33.6 155.7,34.5 155.7,37.5 v153.9,39.3 | v149.7,79.5 PAD26.1
UNUSED_GP4  (via drill 0.61)
  Top 0.254: v162.9,27.8 162.6,27.5 162.6,15.4 162.9,15.1 162.9,13.1 163.2,12.8 163.2,9.4 163.7,8.9 164.4,8.9 164.5,8.8 165.2,8.8 R55.1 | v149.3,31.4 149.3,38.8 153,42.5 153,62 v152.6,62.4 | v144.5,63 144.5,64.2 143.9,64.8 143.9,74.9 145.2,76.2 145.2,76.8 144.3,77.7 v144.3,82.5
  Bottom 0.254: v162.9,27.8 162.6,28.1 157.2,28.1 156.9,27.8 156.3,27.8 155.1,29 152.1,29 151.5,29.6 151.1,29.6 v149.3,31.4 | v152.6,62.4 151.7,63.3 144.8,63.3 v144.5,63 | v144.3,82.5 PAD25.1

### Text on the board
tPlace: 12V POWER | OUT | MCN1 | MCN2 | MCN3 | RCTL | CAN | GND | 12V | CAN 2 | CAN 2 | CAN 2 | CAN A | CAN A | Kvaser | OUT | CAN Mirror | OUT | 12V POWER IN | Sensor Breakout Board | V1.0 | N. C. | CAN2_L | CANA_L | N.C. | CAN2_H | CANA_H | GPS | MCN1 | MCN1 | MCN2 | MCN3 | RCTL